# EAGLE design Netzteil_Darlington_v2 (EAGLE 8.6.3)

## Sheet 1 of 3
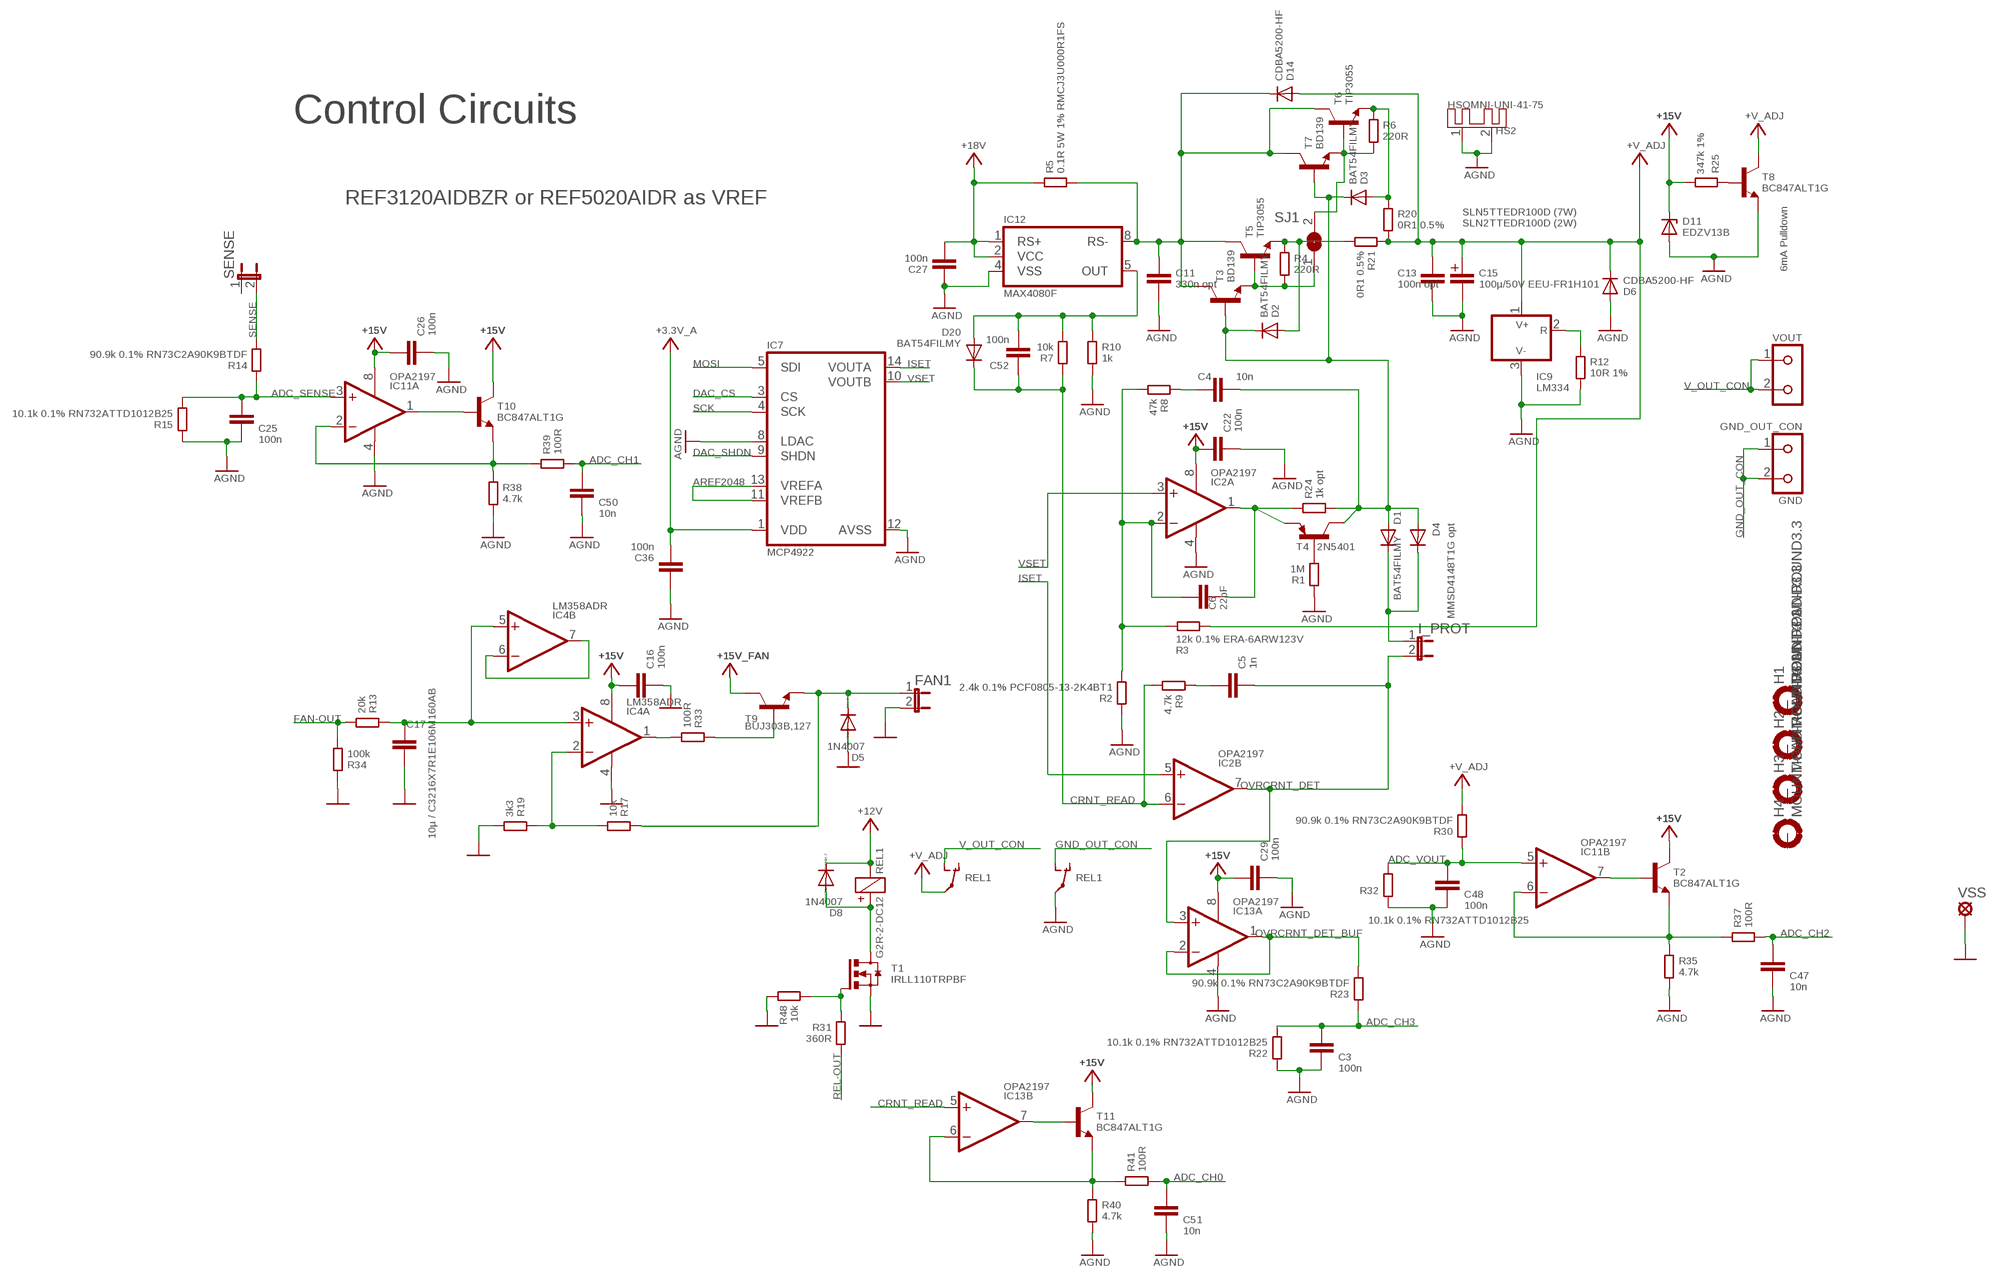
[diagram p0: schematic, sheet 1]

### Parts
C3  100n  CC/0805  [0805]
C4  10n  CC/0805  [0805]
C5  1n  CC/0805  [0805]
C6  22pF  CC/0805  [0805]
C11  330n opt  CC/0805  [0805]
C13  100n opt  CC/0805  [0805]
C15  100µ/50V EEU-FR1H101  C+3.5/8  [C+/3.5/8]
C16  100n  CC/0805  [0805]
C17  10µ / C3216X7R1E106M160AB  CC/1206  [1206]
C22  100n  CC/0805  [0805]
C25  100n  CC/0805  [0805]
C26  100n  CC/0805  [0805]
C27  100n  CC/0805  [0805]
C29  100n  CC/0805  [0805]
C36  100n  CC/0805  [0805]
C47  10n  CC/0805  [0805]
C48  100n  CC/0805  [0805]
C50  10n  CC/0805  [0805]
C51  10n  CC/0805  [0805]
C52  100n  CC/0805  [0805]
D1  BAT54FILMY  DBAT54FILMY  [SOT23]
D2  BAT54FILMY  DBAT54FILMY  [SOT23]
D3  BAT54FILMY  DBAT54FILMY  [SOT23]
D4  MMSD4148T1G opt  DIODESOD-123  [SOD-123]
D5  1N4007  DIODE-DO214AA  [DO214AA]
D6  CDBA5200-HF  [DO214AC-2]
D8  1N4007  DIODE-DO214AA  [DO214AA]
D11  EDZV13B  ZD  [SOD-523]
D14  CDBA5200-HF  [DO214AC-2]
D20  BAT54FILMY  DBAT54FILMY  [SOT23]
FAN1  JP1E  [JP1]
GND_OUT_CON  GND  KL2691311500002  [KL2-691311500002]
H1  MOUNT-PAD-ROUND3.3  [3,3-PAD]
H2  MOUNT-PAD-ROUND3.3  [3,3-PAD]
H3  MOUNT-PAD-ROUND3.3  [3,3-PAD]
H4  MOUNT-PAD-ROUND3.3  [3,3-PAD]
HS2  HSOMNI-UNI-41-75  [OMNI-UNI-41-75]
I_PROT  JP1E  [JP1]
IC2  OPA2197  DUAL-OPVSOP8  [SOP8]
IC4  LM358ADR  DUAL-OPVSOP8  [SOP8]
IC7  MCP4922  [TSSOP14]
IC9  LM334  [TO92-G]
IC11  OPA2197  DUAL-OPVSOP8  [SOP8]
IC12  MAX4080F  MAX4080  [SOP8]
IC13  OPA2197  DUAL-OPVSOP8  [SOP8]
R1  1M  R-SMD0603  [C0603K]
R2  2.4k 0.1% PCF0805-13-2K4BT1  R-SMD0805  [C0805K]
R3  12k 0.1% ERA-6ARW123V  R-SMD0805  [C0805K]
R4  220R  R-SMD0805  [C0805K]
R5  0.1R 5W 1% RMCJ3U000R1FS  R-SHUNTRMC-J3  [RMC-J3]
R6  220R  R-SMD0805  [C0805K]
R7  10k  R-SMD0805  [C0805K]
R8  47k  R-SMD0805  [C0805K]
R9  4.7k  R-SMD0805  [C0805K]
R10  1k  R-SMD0805  [C0805K]
R12  10R 1%  R-SMD0805  [C0805K]
R13  20k  R-SMD0805  [C0805K]
R14  90.9k 0.1% RN73C2A90K9BTDF  R-SMD0805  [C0805K]
R15  10.1k 0.1% RN732ATTD1012B25  R-SMD0805  [C0805K]
R17  10k  R-SMD0805  [C0805K]
R19  3k3  R-SMD0805  [C0805K]
R20  0R1 0.5%  R-SMDSLN2  [SLN2]
R21  0R1 0.5%  R-SMDSLN2  [SLN2]
R22  10.1k 0.1% RN732ATTD1012B25  R-SMD0805  [C0805K]
R23  90.9k 0.1% RN73C2A90K9BTDF  R-SMD0805  [C0805K]
R24  1k opt  R-SMD0805  [C0805K]
R25  347k 1%  R-SMD0805  [C0805K]
R30  90.9k 0.1% RN73C2A90K9BTDF  R-SMD0805  [C0805K]
R31  360R  R-SMD0805  [C0805K]
R32  10.1k 0.1% RN732ATTD1012B25  R-SMD0805  [C0805K]
R33  100R  R-SMD0805  [C0805K]
R34  100k  R-SMD0805  [C0805K]
R35  4.7k  R-SMD0805  [C0805K]
R37  100R  R-SMD0805  [C0805K]
R38  4.7k  R-SMD0805  [C0805K]
R39  100R  R-SMD0805  [C0805K]
R40  4.7k  R-SMD0805  [C0805K]
R41  100R  R-SMD0805  [C0805K]
R48  10k  R-SMD0805  [C0805K]
REL1  G2R-2-DC12  REL-2UG2R2  [REL-G2R2]
SENSE  JP1E  [JP1]
SJ1  SJ  [SJ]
T1  IRLL110TRPBF  T-NMOSFDT457N  [SOT223-4]
T2  BC847ALT1G  T-NPNSOT23-BEC  [SOT23-BEC]
T3  BD139  T-NPNTO126-ECB  [TO126]
T4  2N5401  T-PNPTO92-G-EBC  [TO92-G]
T5  TIP3055  T-NPNTOP3AV-BCE  [TOP3AV]
T6  TIP3055  T-NPNTOP3AV-BCE  [TOP3AV]
T7  BD139  T-NPNTO126-ECB  [TO126]
T8  BC847ALT1G  T-NPNSOT23-BEC  [SOT23-BEC]
T9  BUJ303B,127  -NPN-TO220V  [TO220V]
T10  BC847ALT1G  T-NPNSOT23-BEC  [SOT23-BEC]
T11  BC847ALT1G  T-NPNSOT23-BEC  [SOT23-BEC]
VOUT  KL2691311500002  [KL2-691311500002]
VSS  LSP13  [LSP13]

### Nets
+3.3V_A: C36.2 IC7.1(VDD) ; also sheet 2,3
+12V: D8.C REL1.-(1:-) ; also sheet 2
+15V: C16.1 C22.1 C26.1 C29.1 D11.C IC2.8(PWR:V+) IC4.8(PWR:V+) IC11.8(PWR:V+) IC13.8(PWR:V+) R25.2 T2.C T10.C T11.C ; also sheet 2
+15V_FAN: T9.2(C) ; also sheet 2
+18V: C27.2 IC12.1(RS+) IC12.2(VCC) R5.1 ; also sheet 2
+V_ADJ: C13.1 C15.+ D6.C D14.A IC9.1(V+) R3.1 R20.2 R21.1 R30.2 REL1.P1(2:P) T8.C
ADC_CH0: C51.1 R41.2 ; also sheet 3
ADC_CH1: C50.1 R39.2 ; also sheet 3
ADC_CH2: C47.1 R37.2 ; also sheet 3
ADC_CH3: C3.1 R22.2 R23.1 ; also sheet 3
ADC_SENSE: C25.1 IC11.3(A:+IN) R14.1 R15.2
ADC_VOUT: C48.1 IC11.5(B:+IN) R30.1 R32.2
AGND: C3.2 C11.2 C13.2 C15.- C22.2 C25.2 C26.2 C27.1 C29.2 C36.1 C47.2 C48.2 C50.2 C51.2 D6.A D11.A HS2.1 HS2.2 IC2.4(PWR:V-) IC7.8(LDAC) IC7.12(AVSS) IC9.3(V-) IC11.4(PWR:V-) IC12.4(VSS) IC13.4(PWR:V-) R1.1 R2.1 R10.2 R12.2 R15.1 R22.1 R32.1 R35.2 R38.2 R40.2 REL1.P2(3:P) T8.E ; also sheet 2,3
AREF2048: IC7.11(VREFB) IC7.13(VREFA) ; also sheet 3
CRNT_READ: C52.1 D20.3(C) IC2.6(B:-IN) IC13.5(B:+IN) R7.1 R9.2
DAC_CS: IC7.3(CS) ; also sheet 3
DAC_SHDN: IC7.9(SHDN) ; also sheet 3
FAN-OUT: R13.2 R34.2 ; also sheet 3
GND_OUT_CON: GND_OUT_CON.1 GND_OUT_CON.2 REL1.S2(3:S)
ISET: IC2.5(B:+IN) IC7.14(VOUTA)
MOSI: IC7.5(SDI) ; also sheet 3
N$3: C11.1 D14.C IC12.8(RS-) R5.2 T3.2(C) T5.C T6.C T7.2(C)
N$4: D3.1(A) R6.1 R20.1 T6.E
N$5: R6.2 SJ1.2 T6.B T7.1(E)
N$6: C6.1 IC2.2(A:-IN) R2.2 R3.2 R8.2
N$7: C52.2 D20.1(A) IC12.5(OUT) R7.2 R10.1
N$8: D2.1(A) R4.1 R21.2 T5.E
N$10: D1.3(C) D4.C I_PROT.1
N$11: R25.1 T8.B
N$12: D8.A REL1.+(1:+) T1.2(D) T1.4(D)
N$15: R4.2 SJ1.1 T3.1(E) T5.B
N$16: IC9.2(R) R12.1
N$18: IC4.6(B:-IN) IC4.7(B:OUT)
N$19: R1.2 T4.2(B)
N$21: C6.2 IC2.1(A:OUT) R24.1 T4.1(E)
N$22: C4.2 D1.1(A) D2.3(C) D3.3(C) D4.A R24.2 T3.3(B) T4.3(C) T7.3(B)
N$27: C4.1 R8.1
N$28: C5.1 R9.1
N$30: C17.2 IC4.3(A:+IN) IC4.5(B:+IN) R13.1
N$31: D5.C FAN1.1 R17.1 T9.3(E)
N$32: IC4.2(A:-IN) R17.2 R19.1
N$33: R33.1 T9.1(B)
N$34: IC4.1(A:OUT) R33.2
N$37: R31.1 R48.2 T1.1(G)
N$40: IC11.7(B:OUT) T2.B
N$41: IC11.6(B:-IN) R35.1 R37.1 T2.E
N$42: IC11.1(A:OUT) T10.B
N$43: IC11.2(A:-IN) R38.1 R39.1 T10.E
N$44: IC13.7(B:OUT) T11.B
N$45: IC13.6(B:-IN) R40.1 R41.1 T11.E
OVRCRNT_DET: C5.2 I_PROT.2 IC2.7(B:OUT) IC13.3(A:+IN)
OVRCRNT_DET_BUF: IC13.1(A:OUT) IC13.2(A:-IN) R23.2
REL-OUT: R31.2 ; also sheet 3
SCK: IC7.4(SCK) ; also sheet 3
SENSE: R14.2 SENSE.2
V_OUT_CON: REL1.S1(2:S) VOUT.1 VOUT.2
VSET: IC2.3(A:+IN) IC7.10(VOUTB)
VSS: C16.2 C17.1 D5.A FAN1.2 IC4.4(PWR:V-) R19.2 R34.1 R48.1 T1.3(S) VSS.MP ; also sheet 2,3
Unconnected: H1.B3,3(MOUNT) H2.B3,3(MOUNT) H3.B3,3(MOUNT) H4.B3,3(MOUNT) REL1.O1(2:O) REL1.O2(3:O) SENSE.1

### Notes on the sheet
- Control Circuits
- REF3120AIDBZR or REF5020AIDR as VREF
- SLN5TTEDR100D (7W)
  SLN2TTEDR100D (2W)
- 6mA Pulldown

## Sheet 2 of 3
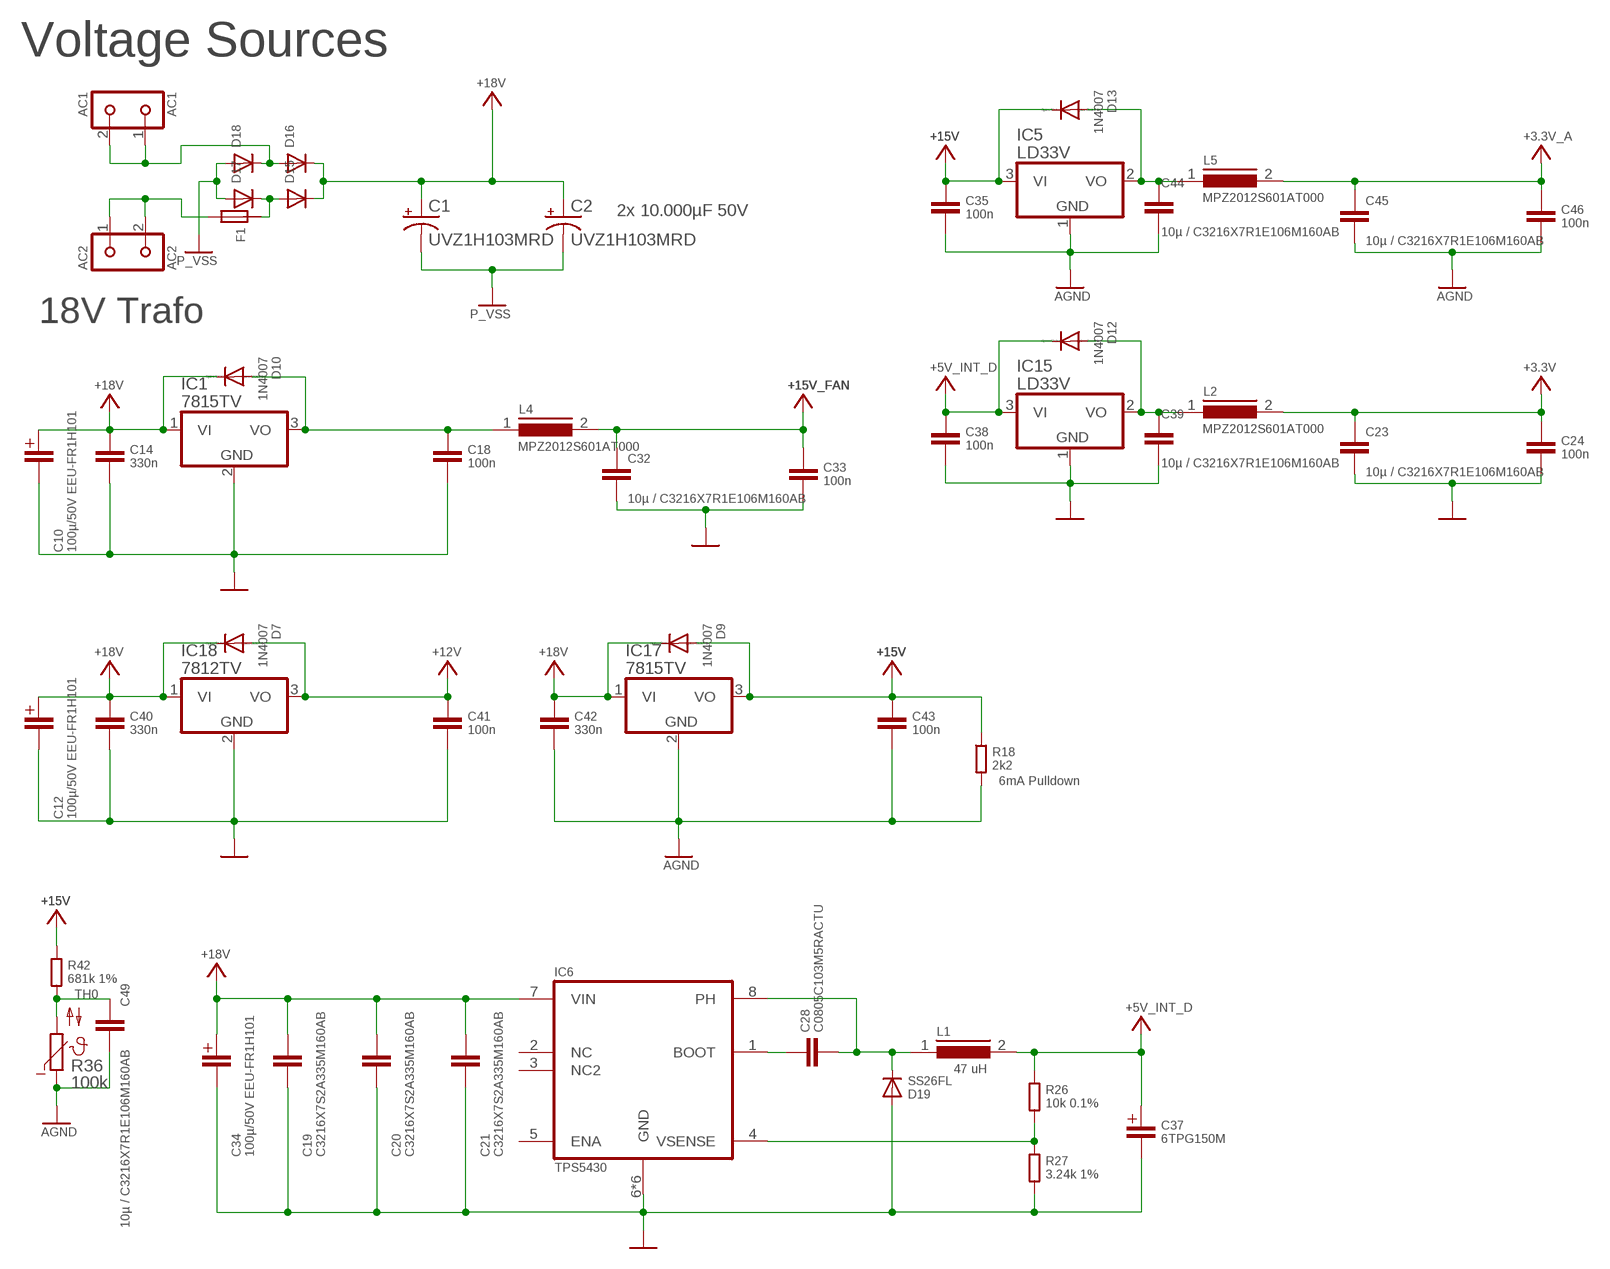
[diagram p1: schematic, sheet 2]

### Parts
AC1  AC1  KL2691311500002  [KL2-691311500002]
AC2  AC2  KL2691311500002  [KL2-691311500002]
C1  UVZ1H103MRD  CPOL-USE10-22.5  [EB22,5D]
C2  UVZ1H103MRD  CPOL-USE10-22.5  [EB22,5D]
C10  100µ/50V EEU-FR1H101  C+3.5/8  [C+/3.5/8]
C12  100µ/50V EEU-FR1H101  C+3.5/8  [C+/3.5/8]
C14  330n  CC/0805  [0805]
C18  100n  CC/0805  [0805]
C19  C3216X7S2A335M160AB  CC/1206  [1206]
C20  C3216X7S2A335M160AB  CC/1206  [1206]
C21  C3216X7S2A335M160AB  CC/1206  [1206]
C23  10µ / C3216X7R1E106M160AB  CC/1206  [1206]
C24  100n  CC/0805  [0805]
C28  C0805C103M5RACTU  CC/0805  [0805]
C32  10µ / C3216X7R1E106M160AB  CC/1206  [1206]
C33  100n  CC/0805  [0805]
C34  100µ/50V EEU-FR1H101  C+3.5/8  [C+/3.5/8]
C35  100n  CC/0805  [0805]
C37  6TPG150M  C-TANTAL  [CT1210]
C38  100n  CC/0805  [0805]
C39  10µ / C3216X7R1E106M160AB  CC/1206  [1206]
C40  330n  CC/0805  [0805]
C41  100n  CC/0805  [0805]
C42  330n  CC/0805  [0805]
C43  100n  CC/0805  [0805]
C44  10µ / C3216X7R1E106M160AB  CC/1206  [1206]
C45  10µ / C3216X7R1E106M160AB  CC/1206  [1206]
C46  100n  CC/0805  [0805]
C49  10µ / C3216X7R1E106M160AB  CC/1206  [1206]
D7  1N4007  DIODE-DO214AA  [DO214AA]
D9  1N4007  DIODE-DO214AA  [DO214AA]
D10  1N4007  DIODE-DO214AA  [DO214AA]
D12  1N4007  DIODE-DO214AA  [DO214AA]
D13  1N4007  DIODE-DO214AA  [DO214AA]
D15  DTO263-PWR  [TO-263AB-PWR]
D16  DTO263-PWR  [TO-263AB-PWR]
D17  DTO263-PWR  [TO-263AB-PWR]
D18  DTO263-PWR  [TO-263AB-PWR]
D19  SS26FL  DSOD123  [SOD-123]
F1  F5X20  [F5X20]
IC1  7815TV  [TO220V]
IC5  LD33V  [TO220V]
IC6  TPS5430  [SOIC8POWERPAD]
IC15  LD33V  [TO220V]
IC17  7815TV  [TO220V]
IC18  7812TV  [TO220V]
L1  47 uH  L744771147  [WE-PD]
L2  MPZ2012S601AT000  L0805  [C0805K]
L4  MPZ2012S601AT000  L0805  [C0805K]
L5  MPZ2012S601AT000  L0805  [C0805K]
R18  2k2  R-SMD0805  [C0805K]
R26  10k 0.1%  R-SMD0805  [C0805K]
R27  3.24k 1%  R-SMD0805  [C0805K]
R36  100k  NTC640  [P640]
R42  681k 1%  R-SMD0603  [C0603K]

### Nets
+3.3V: C23.1 C24.1 L2.2 ; also sheet 3
+3.3V_A: C45.1 C46.1 L5.2 ; also sheet 1,3
+5V_INT_D: C37.+ C38.1 D12.C IC15.3(VI) L1.2 R26.1 ; also sheet 3
+12V: C41.1 D7.A IC18.3(VO) ; also sheet 1
+15V: C35.1 C43.1 D9.A D13.C IC5.3(VI) IC17.3(VO) R18.1 R42.1 ; also sheet 1
+15V_FAN: C32.1 C33.1 L4.2 ; also sheet 1
+18V: C1.+ C2.+ C10.+ C12.+ C14.1 C19.1 C20.1 C21.1 C34.+ C40.1 C42.1 D7.C D9.C D10.C D15.2(C) D15.2_PWR1(C) D15.2_PWR2(C) D15.2_PWR3(C) D15.2_PWR4(C) D15.2_PWR5(C) D15.2_PWR6(C) D15.2_PWR7(C) D15.2_PWR8(C) D15.2_PWR9(C) D15.2_PWR10(C) D15.2_PWR11(C) D15.2_PWR12(C) D16.2(C) D16.2_PWR1(C) D16.2_PWR2(C) D16.2_PWR3(C) D16.2_PWR4(C) D16.2_PWR5(C) D16.2_PWR6(C) D16.2_PWR7(C) D16.2_PWR8(C) D16.2_PWR9(C) D16.2_PWR10(C) D16.2_PWR11(C) D16.2_PWR12(C) IC1.1(VI) IC6.7(VIN) IC17.1(VI) IC18.1(VI) ; also sheet 1
AGND: C35.2 C42.2 C43.2 C44.1 C45.2 C46.2 C49.1 IC5.1(GND) IC17.2(GND) R18.2 R36.1 ; also sheet 1,3
N$1: C28.1 IC6.1(BOOT)
N$2: AC2.1 AC2.2 F1.3 F1.4
N$13: C28.2 D19.-(C) IC6.8(PH) L1.1
N$14: AC1.1 AC1.2 D16.1(A) D16.3(A) D18.2(C) D18.2_PWR1(C) D18.2_PWR2(C) D18.2_PWR3(C) D18.2_PWR4(C) D18.2_PWR5(C) D18.2_PWR6(C) D18.2_PWR7(C) D18.2_PWR8(C) D18.2_PWR9(C) D18.2_PWR10(C) D18.2_PWR11(C) D18.2_PWR12(C)
N$24: IC6.4(VSENSE) R26.2 R27.1
N$25: D15.1(A) D15.3(A) D17.2(C) D17.2_PWR1(C) D17.2_PWR2(C) D17.2_PWR3(C) D17.2_PWR4(C) D17.2_PWR5(C) D17.2_PWR6(C) D17.2_PWR7(C) D17.2_PWR8(C) D17.2_PWR9(C) D17.2_PWR10(C) D17.2_PWR11(C) D17.2_PWR12(C) F1.1 F1.2
N$35: C39.2 D12.A IC15.2(VO) L2.1
N$38: C18.1 D10.A IC1.3(VO) L4.1
N$39: C44.2 D13.A IC5.2(VO) L5.1
P_VSS: C1.- C2.- D17.1(A) D17.3(A) D18.1(A) D18.3(A)
TH0: C49.2 R36.2 R42.2 ; also sheet 3
VSS: C10.- C12.- C14.2 C18.2 C19.2 C20.2 C21.2 C23.2 C24.2 C32.2 C33.2 C34.- C37.- C38.2 C39.1 C40.2 C41.2 D19.+(A) IC1.2(GND) IC6.6(GND) IC6.POWERPAD(GND) IC6.PP1(GND) IC6.PP2(GND) IC6.PP3(GND) IC6.PP4(GND) IC15.1(GND) IC18.2(GND) R27.2 ; also sheet 1,3
Unconnected: IC6.2(NC) IC6.3(NC2) IC6.5(ENA)

### Notes on the sheet
- Voltage Sources
- 2x 10.000µF 50V
- 18V Trafo
- 6mA Pulldown

## Sheet 3 of 3
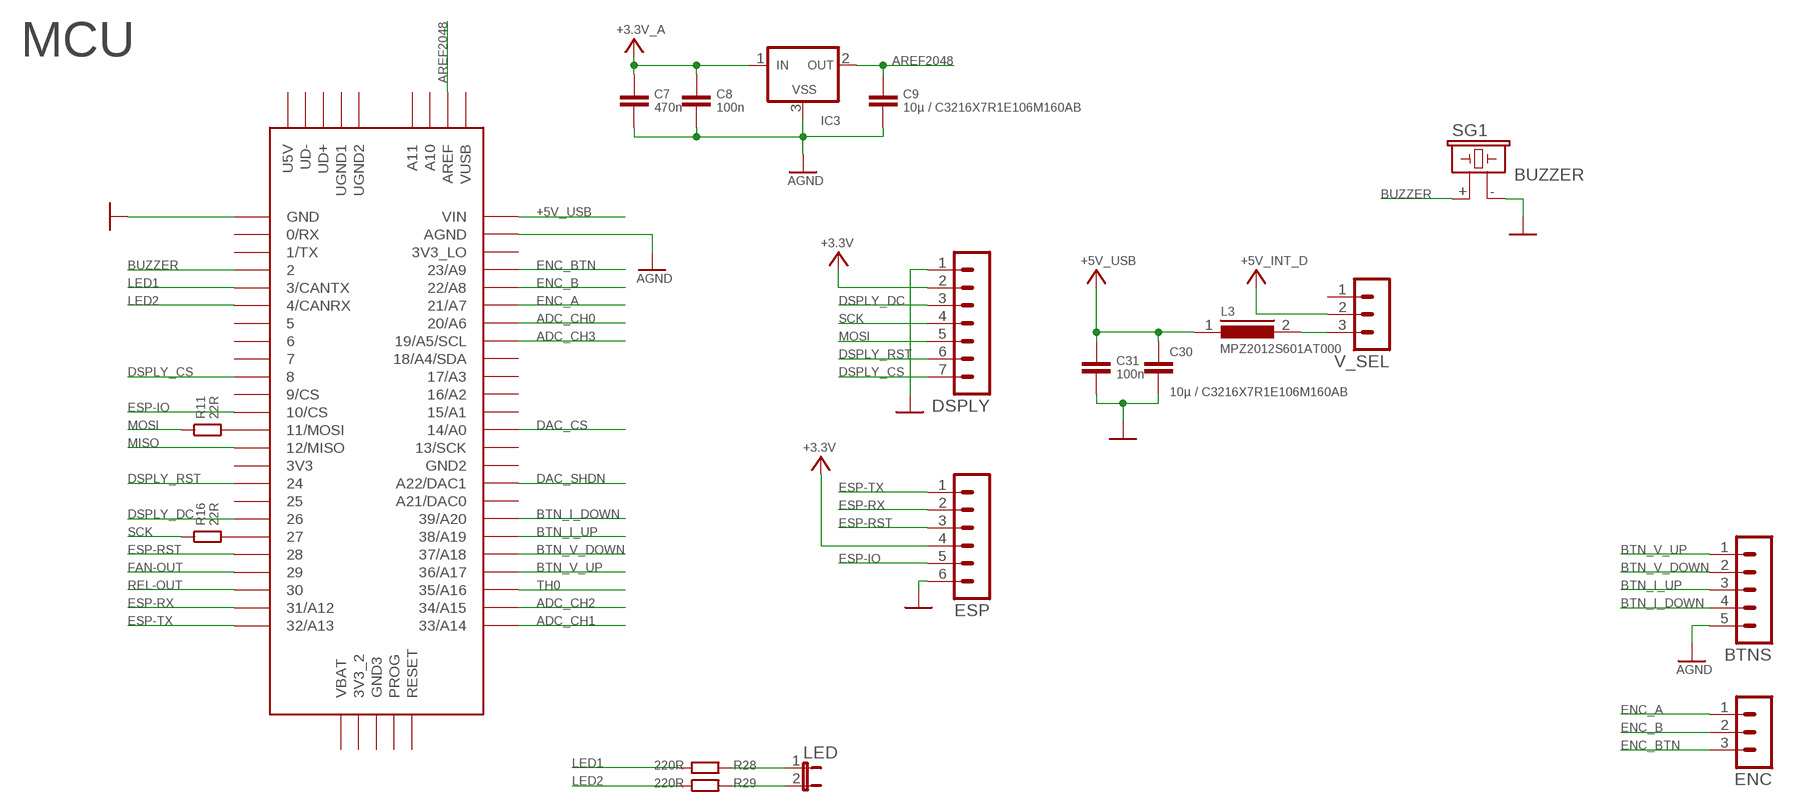
[diagram p2: schematic, sheet 3]

### Parts
BTNS  MA05-1  [MA05-1]
C7  470n  CC/0805  [0805]
C8  100n  CC/0805  [0805]
C9  10µ / C3216X7R1E106M160AB  CC/1206  [1206]
C30  10µ / C3216X7R1E106M160AB  CC/1206  [1206]
C31  100n  CC/0805  [0805]
DSPLY  MA07-1  [MA07-1]
ENC  MA03-1  [MA03-1]
ESP  MA06-1  [MA06-1]
IC3  REF3120  [SOT23]
L3  MPZ2012S601AT000  L0805  [C0805K]
LED  JP1E  [JP1]
R11  22R  R-SMD0805  [C0805K]
R16  22R  R-SMD0805  [C0805K]
R28  220R  R-SMD0805  [C0805K]
R29  220R  R-SMD0805  [C0805K]
SG1  BUZZER  [254-EMB73-RO]
U$33  TEENSY_3.5/3.6  [TEENSY_3.5/3.6]
V_SEL  MA03-1  [MA03-1]

### Nets
+3.3V: DSPLY.2 ESP.4 ; also sheet 2
+3.3V_A: C7.1 C8.1 IC3.1(IN) ; also sheet 1,2
+5V_INT_D: V_SEL.2 ; also sheet 2
+5V_USB: C30.1 C31.1 L3.1 U$33.VIN
ADC_CH0: U$33.20/A6 ; also sheet 1
ADC_CH1: U$33.33/A14 ; also sheet 1
ADC_CH2: U$33.34/A15 ; also sheet 1
ADC_CH3: U$33.19/A5/SCL ; also sheet 1
AGND: BTNS.5 C7.2 C8.2 C9.2 IC3.3(VSS) U$33.AGND ; also sheet 1,2
AREF2048: C9.1 IC3.2(OUT) U$33.AREF ; also sheet 1
BTN_I_DOWN: BTNS.4 U$33.39/A20
BTN_I_UP: BTNS.3 U$33.38/A19
BTN_V_DOWN: BTNS.2 U$33.37/A18
BTN_V_UP: BTNS.1 U$33.36/A17
BUZZER: SG1.+ U$33.2
DAC_CS: U$33.14/A0 ; also sheet 1
DAC_SHDN: U$33.A22/DAC1 ; also sheet 1
DSPLY_CS: DSPLY.7 U$33.8
DSPLY_DC: DSPLY.3 U$33.26
DSPLY_RST: DSPLY.6 U$33.24
ENC_A: ENC.1 U$33.21/A7
ENC_B: ENC.2 U$33.22/A8
ENC_BTN: ENC.3 U$33.23/A9
ESP-IO: ESP.5 U$33.10/CS
ESP-RST: ESP.3 U$33.28
ESP-RX: ESP.2 U$33.31/A12
ESP-TX: ESP.1 U$33.32/A13
FAN-OUT: U$33.29 ; also sheet 1
LED1: R28.1 U$33.3/CANTX
LED2: R29.1 U$33.4/CANRX
MISO: U$33.12/MISO
MOSI: DSPLY.5 R11.1 ; also sheet 1
N$9: R16.2 U$33.27
N$17: R11.2 U$33.11/MOSI
N$20: LED.1 R28.2
N$23: LED.2 R29.2
N$36: L3.2 V_SEL.3
REL-OUT: U$33.30 ; also sheet 1
SCK: DSPLY.4 R16.1 ; also sheet 1
TH0: U$33.35/A16 ; also sheet 2
VSS: C30.2 C31.2 DSPLY.1 ESP.6 SG1.- U$33.GND ; also sheet 1,2
Unconnected: U$33.0/RX U$33.1/TX U$33.3V3 U$33.3V3_2 U$33.3V3_LO U$33.5 U$33.6 U$33.7 U$33.9/CS U$33.13/SCK U$33.15/A1 U$33.16/A2 U$33.17/A3 U$33.18/A4/SDA U$33.21/DAC0(A21/DAC0) U$33.25 U$33.A10 U$33.A11 U$33.GND2 U$33.GND3 U$33.PROG U$33.RESET U$33.U5V U$33.UD+ U$33.UD- U$33.UGND1 U$33.UGND2 U$33.VBAT U$33.VUSB V_SEL.1

### Notes on the sheet
- MCU

## Library data of the parts
AC1 AC2 GND_OUT_CON VOUT = neumluc:KL2: Printklemme 2-polig
BTNS = con-lstb:MA05-1: PIN HEADER; OC_FARNELL: unknown; OC_NEWARK: unknown
C1 C2 = neumluc:CPOL-US: POLARIZED CAPACITOR, American symbol
C3-C9 C11 C13 C14 C16-C33 C35 C36 C38-C52 = goujine:C: Kondensator
C10 C12 C15 C34 = goujine:C+
C37 = neumluc:C-TANTAL
D1-D3 D15-D20 = neumluc:D
D4 = adafruit:DIODE: Diode SMADIODE - SMA Surface Mount Package 20V 1A Schottky Diode Digikey: 641-1014-6-ND DO-1N4148 - Through Hole Small Current Diode SOD-123 20V 1 A (.5mV Vf) Schottky Diode - Digikey: MBRX120TPMSCT-ND SOD-323 10V 570mA (.38mV Vf, 3ns) Schottky Diode - Digikey: ZLLS410CT-ND SOD-523 30V 30mA Schottky Diode (RB751S-40TE61) - Digikey: RB751S-40TE61CT-ND SOT23-R/W - SOT23 Package (R = Solder Paste/Reflow Ovens, W = Hand-Soldering) BAT54Film 40V 300mA - Digikey: 497-7162-1-ND
D5 D7-D10 D12 D13 = diode:DIODE-: DIODE
D6 D14 = neumluc:CDBA5200-HF
D11 = neumluc:ZD
DSPLY = con-lstb:MA07-1: PIN HEADER; OC_FARNELL: unknown; OC_NEWARK: unknown
ENC V_SEL = con-lstb:MA03-1: PIN HEADER; OC_FARNELL: unknown; OC_NEWARK: unknown
ESP = con-lstb:MA06-1: PIN HEADER; OC_FARNELL: unknown; OC_NEWARK: unknown
F1 = goujine:F: Sicherung
FAN1 I_PROT LED SENSE = jumper:JP1E: JUMPER
H1-H4 = holes:MOUNT-PAD-ROUND: MOUNTING PAD, round
HS2 = neumluc:HS
IC1 IC17 IC18 = linear:78*: Positive VOLTAGE REGULATOR Source: http://cache.national.com/ds/LM/LM78L05.pdf http://www.fairchildsemi.com/ds/LM/LM7805.pdf
IC2 IC4 IC11 IC13 = goujine:DUAL-OPV
IC3 = neumluc:REF3120
IC5 IC15 = neumluc:LD33V
IC6 = neumluc:TPS5430
IC7 = neumluc:MCP4922
IC9 = neumluc:LM334: LM134/LM234/LM334 3-Terminal Adjustable Current Sources
IC12 = neumluc:MAX4080
L1 = neumluc:L: High Power Density, High Efficiency, Shielded Inductors; SPICEPREFIX: L
L2-L5 = neumluc:L: High Power Density, High Efficiency, Shielded Inductors
R1-R4 R6-R35 R37-R42 R48 = neumluc:R-SMD: R SMD
R5 = neumluc:R-SHUNT
R36 = ptc-ntc:NTC640: PHILIPS NTC; OC_FARNELL: unknown; OC_NEWARK: unknown
REL1 = goujine:REL-2U
SG1 = neumluc:BUZZER: BUZZER Source: Buerklin; OC_FARNELL: unknown; OC_NEWARK: unknown
SJ1 = jumper:SJ: SMD solder JUMPER
T1 = goujine:T-NMOS: Transistor N-Channel MOSFET
T2 T3 T5-T8 T10 T11 = neumluc:T-NPN: NPN Transistor
T4 = neumluc:T-PNP: PNP Transistor
T9 = transistor:*-NPN-: NPN Transistror BF959 corrected 2008.03.06
U$33 = Teensy356:TEENSY_3.5/3.6
VSS = solpad:LSP13: SOLDER PAD drill 1.3 mm, distributor Buerklin, 12H562

## Board
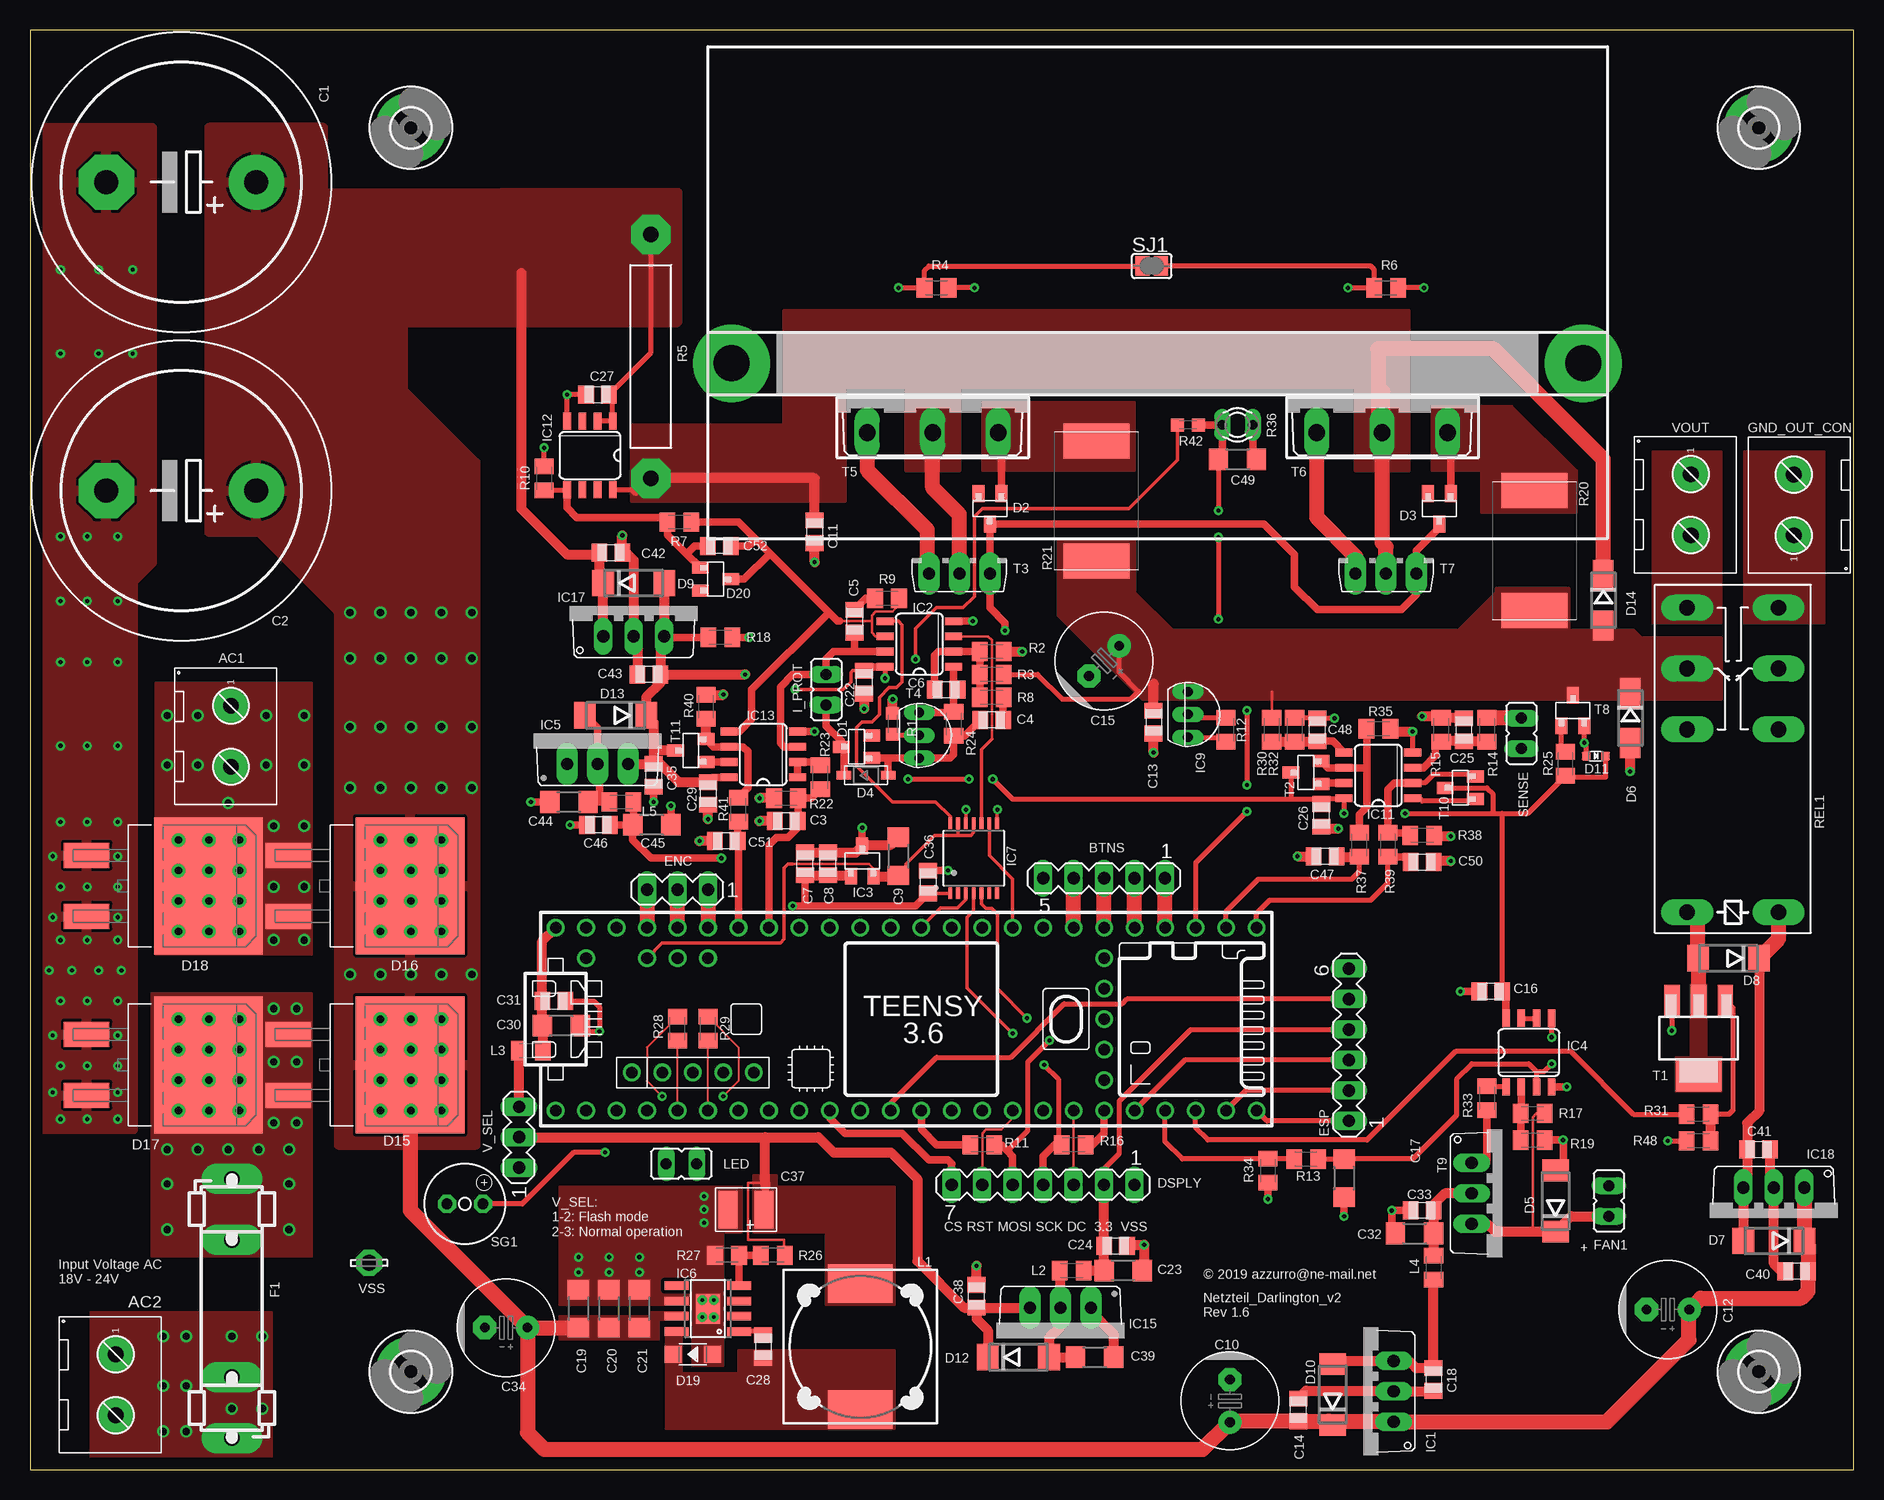
[diagram p3: board, top side]
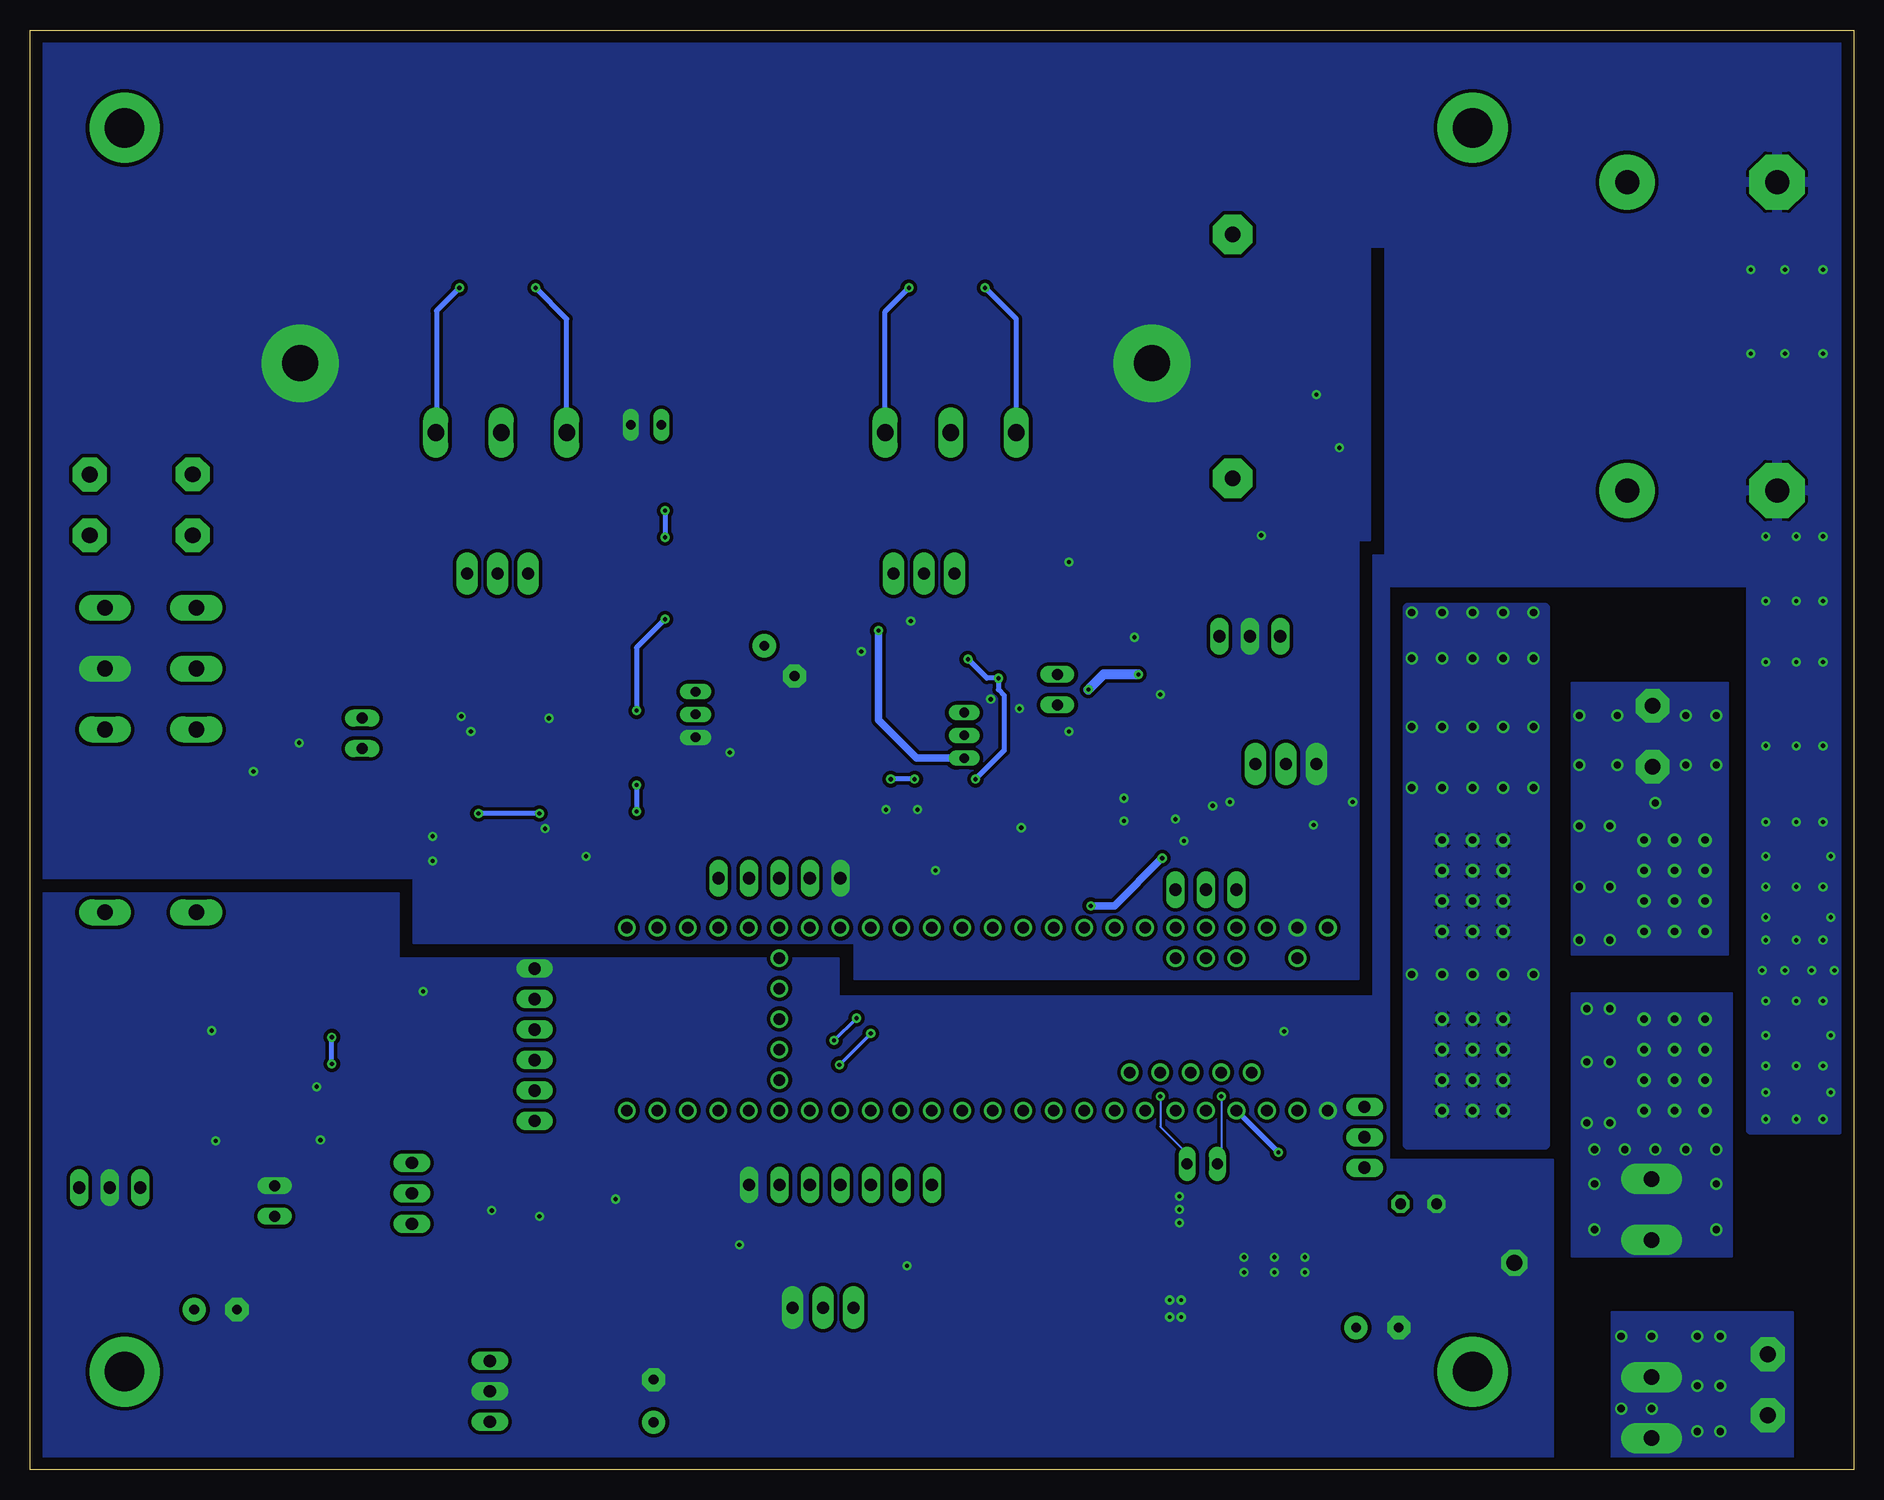
[diagram p4: board, bottom side, seen from below]

Size 152 x 120 mm. Coordinates in mm from the lower left corner, seen from the top.
Outline: 0,0 152,0 152,120 0,120 0,0
Copper layers (1*16): Top 0.035mm / dielectric 1.5mm / Bottom 0.035mm
Design rules "default *": minimum track width 6mil, minimum drill 0.2mm, track to track 6mil, track to pad 6mil, pad to pad 6mil, via to via 6mil, smd to smd 6mil, copper to edge 40mil, drill to drill 6mil, minimum pad ring 10mil, minimum via ring 8mil, stop-mask expansion 4mil, vias tented up to drill 0mil, thermal gap 10mil

### Footprints (pad centres in the part's own frame; a part is rotated, then mirrored left to right if it is on the bottom)
KL2-691311500002 = drill 1.3 pad 2.8 octagon: 1 -2.54,0; 2 2.54,0
MA05-1 = drill 1.016 long: 1 -5.08,0; 2 -2.54,0; 3 0,0; 4 2.54,0; 5 5.08,0
EB22,5D = drill 2.007 pad 4.597: + -6.25,0 | drill 2.007 pad 4.597 octagon: - 6.25,0
0805 = smd 1.3 x 1.5: 1 -0.953,0; 2 0.953,0
1206 = smd 1.803 x 1.6: 1 0,1.587; 2 0,-1.587
C+/3.5/8 = drill 0.813 pad 1.93: + -1.778,0 | drill 0.813 pad 1.93 octagon: - 1.778,0
CT1210 = smd 1.55 x 3.1: + -1.5,0; - 1.5,0
SOT23 = smd 1 x 1.4: 1 -0.953,-1.27; 2 0.953,-1.27; 3 0,1.27
SOD-123 = smd 1.2 x 0.7: A 1.85,0; C -1.85,0
DO214AA = smd 1.8 x 2.2: A 2.55,0; C -2.55,0
DO214AC-2 = smd 2.5 x 1.7: A 2.1,0; C -2.1,0
SOD-523 = smd 0.762 x 0.7: A -0.8,0; C 0.8,0
TO-263AB-PWR = smd 2.08 x 3.8: 1 -2.54,-6.4; 3 2.54,-6.4 | smd 11.43 x 9.05: 2 0,3.75 | drill 0.6: 2_PWR1 -3.81,6.35; 2_PWR2 -1.27,6.35; 2_PWR3 1.27,6.35; 2_PWR4 3.81,6.35; 2_PWR5 3.81,3.81; 2_PWR6 1.27,3.81; 2_PWR7 -1.27,3.81; 2_PWR8 -3.81,3.81; 2_PWR9 -3.81,1.27; 2_PWR10 -1.27,1.27; 2_PWR11 1.27,1.27; 2_PWR12 3.81,1.27
SOD-123' = smd 1.397 x 1.397: + -1.651,0; - 1.651,0
MA07-1 = drill 1.016 long: 1 -7.62,0; 2 -5.08,0; 3 -2.54,0; 4 0,0; 5 2.54,0; 6 5.08,0; 7 7.62,0
MA03-1 = drill 1.016 long: 1 -2.54,0; 2 0,0; 3 2.54,0
MA06-1 = drill 1.016 long: 1 -6.35,0; 2 -3.81,0; 3 -1.27,0; 4 1.27,0; 5 3.81,0; 6 6.35,0
F5X20 = drill 1.3 pad 2.54 long: 1 -11.43,0; 2 -6.35,0; 3 5.08,0; 4 10.16,0
JP1 = drill 0.914 long: 1 0,-1.27; 2 0,1.27
3,3-PAD = drill 3.3 pad 5.842: B3,3 0,0
OMNI-UNI-41-75 = drill 3 pad 6.452: 1 -35.5,2.6; 2 35.5,2.6
TO220V = drill 1.016 long: 1 -2.54,-2.54; 2 0,-2.54; 3 2.54,-2.54
SOP8 = smd 0.635 x 1.422: 1 -1.905,-2.857; 2 -0.635,-2.857; 3 0.635,-2.857; 4 1.905,-2.857; 5 1.905,2.857; 6 0.635,2.857; 7 -0.635,2.857; 8 -1.905,2.857
TO220V' = drill 1 pad 1.778 long: 1 -2.54,0; 2 0,0; 3 2.54,0
SOIC8POWERPAD = smd 0.72 x 2: 1 -1.905,-2.6; 2 -0.635,-2.6; 3 0.635,-2.6; 4 1.905,-2.6; 5 1.905,2.6; 6 0.635,2.6; 7 -0.635,2.6; 8 -1.905,2.6 | smd 2.5 x 2: POWERPAD 0,0 | drill 0.3 pad 0.7: PP1 -0.714,0.476; PP2 0.714,0.476; PP3 -0.714,-0.476; PP4 0.714,-0.476
TSSOP14 = smd 0.305 x 0.991: 1 -1.95,-2.918; 2 -1.3,-2.918; 3 -0.65,-2.918; 4 0,-2.918; 5 0.65,-2.918; 6 1.3,-2.918; 7 1.95,-2.918; 8 1.95,2.918; 9 1.3,2.918; 10 0.65,2.918; 11 0,2.918; 12 -0.65,2.918; 13 -1.3,2.918; 14 -1.95,2.918
TO92-G = drill 0.8 pad 1.27 long: 1 -1.905,0; 2 0,0; 3 1.905,0
WE-PD = smd 3.2 x 5.4: 1 -5.25,0; 2 5.25,0
C0805K = smd 1.3 x 1.6: 1 -1,0; 2 1,0
C0603K = smd 1.05 x 1.08: 1 -0.875,0; 2 0.875,0
RMC-J3 = drill 1.3 pad 3.3 octagon: 1 -10.16,0; 2 10.16,0
SLN2 = smd 2.9 x 5.5: 1 -5,0; 2 5,0
P640 = drill 0.813 long: 1 -1.27,0; 2 1.27,0
REL-G2R2 = drill 1.3 pad 2.184 long: + -12.7,3.81; - -12.7,-3.81; O1 2.54,3.81; O2 2.54,-3.81; P1 7.62,3.81; P2 7.62,-3.81; S1 12.7,3.81; S2 12.7,-3.81
254-EMB73-RO = drill 0.9 pad 1.5 octagon: + 1.5,0; - -1.5,0
SJ = smd 1.168 x 1.6: 1 -0.762,0; 2 0.762,0
SOT223-4 = smd 1.27 x 2.54: 1 -2.223,-3.175; 2 0,-3.175; 3 2.223,-3.175 | smd 3.81 x 2.54: 4 0,3.175
SOT23-BEC = smd 1 x 1.4: B -0.953,-1.27; C 0,1.27; E 0.953,-1.27
TO126 = drill 1 pad 1.778 long: 1 -2.54,0; 2 0,0; 3 2.54,0
TOP3AV = drill 1.397 long: B -5.461,-3.175; C 0,-3.175; E 5.461,-3.175
TEENSY_3.5/3.6 = drill 0.965: 0/RX -25.4,-7.62; 1/TX -22.86,-7.62; 2 -20.32,-7.62; 3/CANTX -17.78,-7.62; 3V3 7.62,-7.62; 3V3_2 17.78,-2.54; 3V3_LO -22.86,7.62; 4/CANRX -15.24,-7.62; 5 -12.7,-7.62; 6 -10.16,-7.62; 7 -7.62,-7.62; 8 -5.08,-7.62; 9/CS -2.54,-7.62; 10/CS 0,-7.62; 11/MOSI 2.54,-7.62; 12/MISO 5.08,-7.62; 13/SCK 5.08,7.62; 14/A0 2.54,7.62; 15/A1 0,7.62; 16/A2 -2.54,7.62; 17/A3 -5.08,7.62; 18/A4/SDA -7.62,7.62; 19/A5/SCL -10.16,7.62; 20/A6 -12.7,7.62; 21/A7 -15.24,7.62; 21/DAC0 12.7,7.62; 22/A8 -17.78,7.62; 23/A9 -20.32,7.62; 24 10.16,-7.62; 25 12.7,-7.62; 26 15.24,-7.62; 27 17.78,-7.62; 28 20.32,-7.62; 29 22.86,-7.62; 30 25.4,-7.62; 31/A12 27.94,-7.62; 32/A13 30.48,-7.62; 33/A14 30.48,7.62; 34/A15 27.94,7.62; 35/A16 25.4,7.62; 36/A17 22.86,7.62; 37/A18 20.32,7.62; 38/A19 17.78,7.62; 39/A20 15.24,7.62; A10 -17.78,5.08; A11 -15.24,5.08; A22/DAC1 10.16,7.62; AGND -25.4,7.62; AREF -20.32,5.08; GND -27.94,-7.62; GND2 7.62,7.62; GND3 17.78,0; PROG 17.78,2.54; RESET 17.78,5.08; U5V -21.59,-4.445; UD+ -16.51,-4.445; UD- -19.05,-4.445; UGND1 -13.97,-4.445; UGND2 -11.43,-4.445; VBAT 17.78,-5.08; VIN -27.94,7.62; VUSB -25.4,5.08
LSP13 = drill 1.321 pad 2.159 octagon: MP 0,0

### Placement (x,y rotation side)
AC1  16.75,61.12 270 top
AC2  7.14,7.06 270 top
BTNS  89.53,49.29 180 top
C1  12.62,107.31 180 top
C2  12.62,81.6 180 top
C3  63.02,54.05 180 top
C4  80.17,62.47 180 top
C5  68.74,70.72 270 top
C6  76.36,65.01 0 top
C7  64.61,50.48 90 top
C8  66.52,50.48 90 top
C9  72.39,51.12 180 top
C10  100.01,5.71 90 top
C11  65.41,78.19 270 top
C12  136.53,13.34 180 top
C13  93.66,62.31 270 top
C14  105.72,4.98 90 top
C15  89.54,67.41 225 top
C16  121.76,39.85 180 top
C17  109.54,24.29 180 top
C18  117,7.52 270 top
C19  45.72,13.41 180 top
C20  48.26,13.41 180 top
C21  50.8,13.41 180 top
C22  69.53,65.64 270 top
C23  91.12,16.59 90 top
C24  90.49,18.65 0 top
C25  119.54,61.67 90 top
C26  107.63,54.53 270 top
C27  47.31,89.61 0 top
C28  61.12,10.24 270 top
C29  56.52,56.36 270 top
C30  44.29,36.99 90 top
C31  43.66,39.05 0 top
C32  115.41,19.68 270 top
C33  116.05,21.59 180 top
C34  39.69,11.83 180 top
C35  51.99,57.86 270 top
C36  74.85,48.97 270 top
C37  59.69,21.67 180 top
C38  78.9,14.45 90 top
C39  88.74,9.36 270 top
C40  147.27,16.52 180 top
C41  144.09,26.68 0 top
C42  48.42,76.44 0 top
C43  51.59,66.28 180 top
C44  44.93,55.64 90 top
C45  51.83,53.74 90 top
C46  47.39,53.74 180 top
C47  107.95,51.12 180 top
C48  107.31,61.67 90 top
C49  100.65,84.22 270 top
C50  116.05,50.64 0 top
C51  58.02,52.39 180 top
C52  57.47,76.99 180 top
D1  68.9,60.25 90 top
D2  80.01,80.09 180 top
D3  117.47,80.09 180 top
D4  69.69,57.87 0 top
D5  127.16,22.38 90 top
D6  133.38,62.64 270 top
D7  145.36,19.06 180 top
D8  141.58,42.61 180 top
D9  50.32,73.9 0 top
D10  108.58,6.25 90 top
D11  130.52,59.47 0 top
D12  82.39,9.36 0 top
D13  48.82,62.87 180 top
D14  131.13,72.47 270 top
D15  27.94,33.73 270 top
D16  27.94,48.66 270 top
D17  11.11,33.73 270 top
D18  11.11,48.66 270 top
D19  SS26FL  [SOD-123']  55.24,9.61 180 top
D20  57.15,74.22 270 top
DSPLY  84.45,23.73 180 top
ENC  53.98,48.34 180 top
ESP  109.93,35.4 90 top
F1  16.83,12.78 270 top
FAN1  131.6,22.38 0 top
GND_OUT_CON  147.02,80.4 90 top
H1  31.75,111.84 0 top
H2  31.75,8.16 0 top
H3  144.12,8.16 0 top
H4  144.12,111.84 0 top
HS2  93.98,89.61 0 top
I_PROT  66.36,65.01 0 top
IC1  111.12,6.51 90 top
IC2  74.14,68.82 90 top
IC3  69.37,50.72 0 top
IC4  124.94,34.77 0 top
IC5  LD33V  [TO220V']  47.31,58.82 0 top
IC6  56.52,13.41 90 top
IC7  78.66,50.96 0 top
IC9  96.52,62.95 270 top
IC11  112.39,57.87 90 top
IC12  46.67,84.53 180 top
IC13  61.12,59.61 90 top
IC15  LD33V  [TO220V']  85.88,13.49 180 top
IC17  50.32,71.99 0 top
IC18  145.36,20.97 180 top
L1  69.22,10.24 90 top
L2  86.84,16.59 0 top
L3  41.75,34.92 180 top
L4  117,16.83 90 top
L5  49.29,55.64 0 top
LED  54.29,25.48 270 top
R1  71.91,62.15 270 top
R2  80.17,68.18 180 top
R3  80.17,66.28 180 top
R4  75.56,98.5 180 top
R5  51.75,92.79 270 top
R6  113.03,98.5 180 top
R7  54.13,78.98 180 top
R8  80.17,64.37 180 top
R9  71.44,72.63 0 top
R10  42.86,82.63 90 top
R11  79.38,27.07 180 top
R12  99.69,61.67 270 top
R13  106.36,25.88 180 top
R14  121.44,61.67 90 top
R15  117.63,61.67 270 top
R16  87,27.07 0 top
R17  125.25,29.69 180 top
R18  57.55,69.37 0 top
R19  125.25,27.46 0 top
R20  125.41,76.6 270 top
R21  88.9,80.72 90 top
R22  63.02,55.96 0 top
R23  65.88,57.71 90 top
R24  76.99,62.15 270 top
R25  127.98,58.83 270 top
R26  61.91,17.86 180 top
R27  58.1,17.86 180 top
R28  53.97,36.75 90 top
R29  56.51,36.75 90 top
R30  103.5,61.67 90 top
R31  139.07,29.62 180 top
R32  105.41,61.67 270 top
R33  121.44,30.96 90 top
R34  103.19,24.92 90 top
R35  112.39,61.75 0 top
R36  100.65,87.08 180 top
R37  110.81,52.07 270 top
R38  116.05,52.86 0 top
R39  113.19,52.07 270 top
R40  56.36,63.58 90 top
R41  59.05,55.01 270 top
R42  96.52,87.08 0 top
R48  139.07,27.4 0 top
REL1  141.95,59.15 90 top
SENSE  124.31,61.36 0 top
SG1  36.26,22.14 0 top
SJ1  93.5,100.33 0 top
T1  139.09,35.95 180 top
T2  106.36,58.1 90 top
T3  77.47,74.69 0 top
T4  74.14,61.2 270 top
T5  75.25,89.61 0 top
T6  112.71,89.61 0 top
T7  113.03,74.69 0 top
T8  128.61,63.28 0 top
T9  122.71,23.02 270 top
T10  119.22,56.83 90 top
T11  55.09,59.93 90 top
U$33  71.76,37.54 0 top
V_SEL  40.76,27.7 90 top
VOUT  138.44,80.43 270 top
VSS  28.26,17.23 0 top

### Tracks (layer width: path | path; a pad name or v marks a point on that pad's centre or on a via)
+3.3V
  Top 0.406: DSPLY.2 89.53,25.08 90.81,26.35 90.81,30.72 96.76,36.67 ESP.4
  Top 0.813: L2.2 C23.1 C24.1 DSPLY.2
+3.3V_A  (via drill 0.35)
  Top 0.305: 68.42,49.69 68.42,49.53 | C36.2 76.53,48.02 IC7.1
  Top 0.61: L5.2 50.29,53.78 C45.1 | C45.1 C46.1 | C45.1 50.24,52.47 51.75,50.96 v57.63,50.96 | C36.2 73.82,46.99 64.61,46.99 | v63.58,46.99 64.61,46.99 | C7.1 64.61,46.99 | 64.61,46.99
  Top 0.813: C7.1 C8.1 68.42,49.53 IC3.1
  Bottom 0.61: v63.58,46.99 61.59,46.99 v57.63,50.96
+5V_INT_D
  Top 0.203: R26.1 62.87,17.91 62.87,19.13 59.85,19.13 59.85,23.89 61.28,23.89 | 61.28,23.57 61.28,21.76 C37.+
  Top 0.813: 79.53,9.06 D12.C | D12.C 79.84,9.69 79.53,10 | 61.28,23.57 61.28,23.89 61.28,27.7 | V_SEL.2 61.28,27.7 | 61.28,27.7 65.72,27.7 66.99,26.43 71.75,26.43 73.98,24.21 73.98,17.38 77.87,13.49 C38.1 | C38.1 IC15.3 | C38.1 78.9,12.54 79.84,11.6 D12.C
  pour Top (isolate 0.305, no thermals): 60.33,19.77 66.36,19.77 66.36,13.73 72.07,13.73 72.07,23.57 62.23,23.57 62.23,24.53 60.33,24.53
+5V_USB
  Top 0.813: L3.1 42.75,36.94 C30.1 C31.1 42.7,44.05 U$33.VIN
+12V
  Top 0.813: D7.A 142.81,23.5 IC18.3 143.14,23.82 C41.1 143.14,28.88 144.13,29.87 D8.C
  Top 1.27: D8.C 145.76,44.24 REL1.-
+15V  (via drill 0.35)
  Top 0.305: C22.1 68.58,66.6 68.42,66.44 68.42,65.64 67.79,65.01 v63.78,65.01 | v73.82,67.55 73.82,70.09 75.56,71.83 77.79,71.83 78.74,72.79 78.74,79.45 79.38,80.09 91.6,80.09 95.64,84.14 R42.1
  Top 0.406: IC2.8 v71.28,65.96 | v73.18,57.55 v78.26,57.55 | D11.C 131.32,57.72 128.09,57.72 R25.2 124.84,54.69 122.71,54.69 | v109.54,54.69 109.54,55.64 IC11.8 109.46,55.88 108.03,55.88 C26.1 107.23,55.88 105.09,55.88 | v114.62,54.69 121.92,54.69 | 121.92,54.69 122.71,54.69 | C16.1 122.71,54.69 | v80.25,57.55 81.92,55.88 105.09,55.88 | T2.C 105.09,55.88 | 121.92,54.69 121.92,56.36 121.44,56.83 T10.C
  Top 0.61: IC2.8 69.69,66.91 C22.1 | C16.1 123.03,39.53 IC4.8 | IC17.3 52.94,69.37 R18.1 | C29.1 56.91,57.71 IC13.8
  Top 0.813: C43.1 52.55,69.14 IC17.3 52.86,73.89 D9.A | C43.1 v59.61,66.28 | C43.1 52.55,65.56 51.37,64.38 D13.C 51.99,62.24 51.99,59.93 | 51.99,59.93 C35.1 | IC5.3 C35.1 | C35.1 52.55,58.82 54.05,57.31 C29.1 | T11.C 51.99,59.93
  Bottom 0.406: v73.18,57.55 70.8,59.93 70.8,64.53 71.28,65.01 v71.28,65.96 72.23,65.96 v73.82,67.55 | v78.26,57.55 v80.25,57.55 | v109.54,54.69 v114.62,54.69
  Bottom 0.813: v59.61,66.28 62.51,66.28 v63.78,65.01
+15V_FAN
  Top 0.813: T9.2 117.95,23.02 117,22.07 C33.1 C32.1 L4.2
+18V  (via drill 0.6)
  Top 0.406: IC12.2 IC12.1 48.58,89.3 C27.2 51.75,93.11 R5.1
  Top 0.813: IC17.1 47.78,73.89 D9.C | D9.C 47.47,74.21 C42.1 47.31,76.28 44.77,76.28 40.96,80.09 40.96,99.73 | IC18.1 147.91,23.5 | D7.C 148.22,18.75 | D9.C 47.46,73.58 | C19.1 45.59,11.95 45.47,11.83 | 108.31,3.97 108.25,4.02
  Top 1.27: 147.91,23.5 D7.C | 148.22,18.75 C40.1 148.22,14.87 147.64,14.29 139.26,14.29 C12.+ 138.27,13.3 138.27,10.79 131.44,3.97 IC1.1 108.31,3.97 | C34.+ 31.69,21.6 D15.2 | C34.+ 45.47,11.83 | C34.+ 41.47,3.06 42.86,1.67 97.74,1.67 C10.+ 100.1,4.02 C14.1 108.25,4.02 D10.C
  other vias: 26.67,56.83 26.67,61.91 26.67,67.63 29.21,56.83 29.21,61.91 29.21,67.63 31.75,56.83 31.75,61.91 31.75,67.63 34.29,56.83 34.29,61.91 34.29,67.63 36.83,67.63 36.83,61.91 36.83,56.83 26.67,41.27 29.21,41.27 31.75,41.27 34.29,41.27 36.83,41.27 26.67,71.44 29.21,71.44 31.75,71.44 34.29,71.44 36.83,71.44
  pour Top (isolate 0.305, no thermals): 54.77,12.46 54.77,13.1 51.75,13.1 51.75,12.78 44.13,12.78 44.13,10.88 52.39,10.88 52.39,12.46
  pour Top (isolate 0.305): 25.72,71.52 25.72,27.07 37.15,27.07 37.15,83.9 31.11,89.93 31.11,95.65 53.98,95.65 53.98,106.44 24.45,106.36 24.45,111.84 14.92,111.84 14.92,78.19 19.05,78.19
  pour Bottom (isolate 0.305): 25.72,71.84 25.72,27.07 37.15,27.07 37.15,71.84
+V_ADJ
  Top 0.203: R30.2 103.5,64.85
  Top 0.406: R3.1 83.99,66.28 86.05,64.22 91.77,64.22 92.4,64.86 90.79,66.46 C15.+
  Top 0.813: C13.1 93.66,65.48
  pour Top (isolate 0.305, no thermals): 92.08,77.55 85.72,77.55 85.72,71.2 92.71,64.22 140.97,64.22 140.97,69.29 134.31,69.3 133.68,69.94 128.27,69.93 128.27,73.42 122.24,73.42 122.24,73.11 119.06,69.93 95.25,69.93 92.08,73.11
ADC_CH0
  Top 0.61: U$33.20/A6 59.06,52.31 C51.1 58.98,53.93 R41.2
ADC_CH1
  Top 0.406: U$33.33/A14 102.24,46.36 103.35,47.47 111.76,47.47 113.19,48.9 R39.2
  Top 0.61: R39.2 114.98,51.07 C50.1
ADC_CH2
  Top 0.406: U$33.34/A15 99.7,46.52 102.39,49.21 110.17,49.21 110.81,49.85 R37.2
  Top 0.813: C47.1 108.95,51.07 R37.2
ADC_CH3
  Top 0.61: R23.1 65.14,55.96 R22.2 64.02,54.1 C3.1 | C3.1 64.14,53.9 | C3.1 64.14,53.89 | C3.1 63.98,53.5 63.18,52.7 62.23,52.7 61.6,52.07 U$33.19/A5/SCL
ADC_SENSE
  Top 0.61: IC11.3 116.13,58.5 117.16,59.53 117.16,60.48 117.35,60.67 R15.2
  Top 0.813: R14.1 119.58,60.67 C25.1 117.68,60.72 R15.2
ADC_VOUT
  Top 0.203: 107.63,60.41 C48.1
  Top 0.61: C48.1 108.58,60.72 IC11.5
  Top 0.813: R30.1 R32.2 | R32.2 105.46,60.72 | R32.2 107.27,60.67 C48.1
AGND  (via drill 0.35)
  Top 0.305: IC7.12 78.01,54.99 v78.03,55.01 | IC7.8 80.61,54.97 v80.64,55.01
  Top 0.406: C27.1 v44.77,89.61 IC12.4 | R10.2 v42.86,85.17 | R12.2 99.33,61.04 IC9.3 | R32.1 107.27,62.67 C48.2 v108.74,62.63 | IC11.4 v115.25,61.52 | D11.A 129.72,60.42 v129.56,60.58 T8.E
  Top 0.61: IC2.4 v78.58,70.72 | IC13.4 v65.41,61.52 | C49.1 101.92,84.53 R36.1 | R18.2 v59.93,69.37 | C45.2 v53.42,55.33 | v41.75,55.64 C44.1 | C46.2 | C46.2 v45.01,53.74 | v69.37,53.5 69.37,52.07 IC3.3 | C36.1 75.01,49.93 v76.52,49.93 | v51.99,55.64 C35.2
  Top 0.813: C43.2 50.64,69.14 IC17.2 50.32,75.8 49.69,76.44 C42.2 v49.37,77.87 | v65.41,75.64 C11.2 | v93.66,59.77 C13.2 | v133.38,58.2 D6.A | C22.2 v69.53,63.42 | R2.1 v82.71,68.18 | R1.1 v71.91,64.22 | R22.1 v60.8,55.96 | C3.2 v60.8,54.05 | C7.2 C8.2 68.82,51.44 IC3.3 69.45,52.07 71.75,52.07 C9.2 | C26.2 107.79,53.42 v109.06,53.42 | R35.2 113.63,61.52 v115.25,61.52 | 106.92,51.04 C47.2 v105.65,51.12 | v118.43,52.78 117.12,52.78 R38.2 | v118.43,50.72 117.08,50.72 C50.2 | C25.2 117.68,62.63 R15.1 117.52,62.79 v116.05,62.79 | v56.52,54.21 C29.2 | R40.2 57.75,64.58 v57.78,64.61 | C51.2 v55.8,52.39
  pour Bottom (isolate 0.305, no thermals): 40.32,119.46 151.74,119.46 151.74,49.29 120.02,49.29 120.02,43.9 83.26,43.9 83.26,40.88 41.27,40.88 41.27,77.47 40.32,77.47
AREF2048
  Top 0.203: IC3.2 70.32,50.09 69.93,50.48 63.58,50.48
  Top 0.305: IC7.11 78.66,53.1 78.42,52.86 77.23,52.86 | 77.23,52.86 77.36,52.89 IC7.13 | U$33.AREF 52.71,43.89 62.55,43.89 62.87,44.21 62.87,50.16 63.18,50.48 63.58,50.48 | C9.1 73.03,50.17 73.03,50.48 75.41,52.86 77.23,52.86
  Top 0.813: IC3.2 72.31,49.45 C9.1
BTN_I_DOWN
  Top 1.27: U$33.39/A20 BTNS.4
BTN_I_UP
  Top 1.27: U$33.38/A19 BTNS.3
BTN_V_DOWN
  Top 1.27: U$33.37/A18 BTNS.2
BTN_V_UP
  Top 1.27: U$33.36/A17 BTNS.1
BUZZER  (via drill 0.35)
  Top 0.406: v47.94,26.43 45.32,26.43 41.04,22.15 SG1.+
  Bottom 0.406: U$33.2 v47.95,26.43 v47.94,26.43
CRNT_READ
  Top 0.203: 70.17,70.72 70.17,71.2 70.48,71.52 71.91,71.52 72.44,72.04 R9.2 | 67.47,70.72 70.17,70.72 | IC2.6 70.48,69.45 70.17,69.77 70.17,70.72
  Top 0.61: 66.52,71.52 67.31,70.72 67.47,70.72 | 66.52,71.52 66.52,71.36 60.17,65.01 60.17,62.55 59.13,61.52 | 60.48,77.55 59.05,78.98 R7.1 | 60.48,77.55 61.67,76.36 | 61.67,76.36 66.52,71.52 | 59.13,61.52 | 59.13,61.52 IC13.5 | D20.3 59.53,74.22 61.67,76.36 | C52.1 59.93,76.99 60.48,77.55
DAC_CS
  Top 0.305: IC7.3 78.01,47.53 77.31,46.83 75.88,46.83 74.3,45.25 U$33.14/A0
DAC_SHDN
  Top 0.305: IC7.9 79.96,51.17 81.92,49.21 U$33.A22/DAC1
DSPLY_CS
  Top 0.61: DSPLY.7 76.83,25.48 76.52,25.8 74.93,25.8 72.71,28.02 67.94,28.02 66.68,29.29 U$33.8
DSPLY_DC
  Top 0.203: DSPLY.3 U$33.26
DSPLY_RST
  Top 0.203: DSPLY.6 79.38,24.21 79.38,28.02 79.69,28.34 80.96,28.34 81.92,29.29 U$33.24
ENC_A
  Top 1.27: ENC.1 U$33.21/A7
ENC_B
  Top 1.27: U$33.22/A8 ENC.2
ENC_BTN
  Top 1.27: ENC.3 U$33.23/A9
ESP-IO
  Top 0.406: U$33.10/CS 71.76,30.56 75.56,34.37 81.76,34.37 86.2,38.81 91.04,38.81 91.44,39.21 ESP.5
ESP-RST
  Top 0.406: ESP.3 96.28,34.13 U$33.28
ESP-RX
  Top 0.406: ESP.2 101.36,31.59 U$33.31/A12
ESP-TX
  Top 0.406: ESP.1 103.11,29.05 U$33.32/A13
FAN-OUT
  Top 0.406: R13.2 105.31,25.92 R34.2 103.14,25.88 96.04,25.88 94.62,27.3 U$33.29
GND_OUT_CON
  pour Top (isolate 0.305, no thermals): 149.56,70.57 142.89,70.57 142.89,84.86 149.56,84.86
ISET
  Top 0.305: IC2.5 72.39,70.72 72.71,70.41 72.71,65.64 72.23,65.17 71.6,65.17 70.8,64.37 70.8,62.95 70.17,62.31 69.37,62.31 68.9,61.83 68.9,58.66 71.91,55.64 75.49,55.64 76.71,54.42 IC7.14
LED1
  Top 0.152: U$33.3/CANTX R28.1
LED2
  Top 0.152: U$33.4/CANRX R29.1
MOSI  (via drill 0.35)
  Top 0.305: IC7.5 79.31,47.13 79.69,46.75 80.17,46.75 80.64,46.28 80.64,40.08 v83.11,37.62
  Top 0.406: 81.48,26.55 83.19,28.26 83.19,33.97 v84.97,35.76
  Top 0.61: R11.1 80.96,27.07 81.48,26.55 81.91,26.12 DSPLY.5
  Top 1.27: R11.1
  Bottom 0.305: v83.11,37.62 v84.97,35.76
N$1
  Top 0.406: C28.1 60.8,11.51 IC6.1
N$2  (via drill 0.6)
  other vias: 11.11,11.11 11.11,6.99 11.11,3.17 13.02,3.17 13.02,6.99 13.02,11.11 16.83,11.11 19.37,11.11 16.83,5.08 19.37,5.08
  pour Top (isolate 0.305, no thermals): 5.08,1.03 20.16,1.03 20.16,13.1 5.08,13.1
  pour Bottom (isolate 0.305, no thermals): 5.08,1.03 20.16,1.03 20.16,13.1 5.08,13.1
N$3
  Top 0.406: IC12.8 50.16,81.68 50.48,81.36 R5.2
  Top 0.813: C11.1 65.41,82.63 R5.2
  Top 1.27: T6.C 112.71,77.23 113.03,76.92 T7.2 | 112.71,89.93 T6.C | T6.C 112.39,86.76 112.39,93.42 121.92,93.42 121.93,93.43 131.13,84.24 D14.C | T3.2 77.47,79.61 75.25,81.84 T5.C
  pour Top (isolate 0.305, no thermals): 50.16,87.08 50.16,80.72 67.94,80.72 67.94,90.25 73.03,90.25 73.03,83.27 77.47,83.27 77.47,90.25 110.49,90.25 110.49,83.27 114.94,83.27 114.94,96.6 62.87,96.6 62.87,87.08
N$4  (via drill 0.35)
  Top 0.406: 118.43,86.19 T6.E | v116.2,98.5 R6.1
  Top 0.61: D3.1 118.43,86.19
  Bottom 0.406: v116.2,98.5 118.11,96.6 118.11,86.5 T6.E
  pour Top (isolate 0.305, no thermals): 116.84,88.66 123.53,88.66 128.92,83.27 128.9,79.77 120.99,79.77 120.98,83.27 116.84,83.27
N$5  (via drill 0.35)
  Top 0.406: v109.86,98.5 R6.2 112.03,100.06 111.76,100.33 SJ1.2
  Top 1.27: T7.1 110.49,76.12 107.25,79.36 T6.B
  Bottom 0.406: v109.86,98.5 107.25,95.9 T6.B
N$6
  Top 0.61: C6.1 75.41,67.87 75.72,68.18 IC2.2 R2.2 R3.2 R8.2
N$7
  Top 0.406: R10.1 44.72,81.63 IC12.5
  Top 0.61: IC12.5 44.77,80.17 45.56,79.38 52.74,79.38 R7.2 53.13,77.91 54.73,76.32 | 54.73,76.32 D20.1 | C52.2 55.4,76.99 54.73,76.32
N$8  (via drill 0.35)
  Top 0.406: 80.96,86.19 T5.E | v78.74,98.5 R4.1
  Top 0.61: D2.1 80.96,86.19
  Bottom 0.406: v78.74,98.5 80.71,96.54 T5.E
  pour Top (isolate 0.305, no thermals): 79.38,88.98 92.08,88.98 92.08,83.27 79.38,83.27
N$9
  Top 0.61: R16.2 88.58,27.07 89.54,28.02 U$33.27
N$10
  Top 0.61: I_PROT.1 66.36,61.99 67.63,60.72 D1.3 67.84,60.03 D4.C
N$11
  Top 0.406: R25.1 127.66,60.15 T8.B
N$12
  Top 1.27: T1.2 139.09,42.55 D8.A 139.03,45.88 REL1.+
  pour Top (isolate 0.305, no thermals): 137.18,31.5 137.18,34.36 138.45,34.36 138.45,40.39 139.72,40.39 139.72,34.36 140.99,34.36 140.99,31.5
N$13
  pour Top (isolate 0.305, no thermals): 54.29,11.83 53.02,11.83 53.02,3.41 72.07,3.41 72.07,9.92 59.05,9.92 59.05,8.02 54.29,8.02
N$14  (via drill 0.6)
  other vias: 19.68,58.74 16.51,55.56 13.97,58.74 11.43,58.74 22.86,58.74 22.86,44.13 20.32,44.13 20.32,48.58 22.86,48.58 22.86,53.66 20.32,53.66 11.43,62.87 13.97,62.87 19.68,62.87 22.86,62.87
  pour Top (isolate 0.305, no thermals): 10.48,65.56 10.48,42.94 23.49,42.94 23.49,65.56
  pour Bottom (isolate 0.305, no thermals): 10.48,65.56 10.48,42.94 23.49,42.94 23.49,65.56
N$15  (via drill 0.35)
  Top 0.406: v72.39,98.5 R4.2 74.56,99.97 74.93,100.33 SJ1.1
  Top 1.27: T5.B 69.79,83.33 74.77,78.34 74.77,74.85 T3.1
  Bottom 0.406: v72.39,98.5 69.79,95.9 T5.B
N$16
  Top 0.406: IC9.2 96.79,62.67 R12.1
N$17
  Top 0.61: R11.2 75.57,27.07 75.56,27.07 74.3,28.34 U$33.11/MOSI
N$18
  Top 0.406: IC4.7 IC4.6
N$19
  Top 0.406: T4.2 71.99,61.2 R1.2
N$20  (via drill 0.35)
  Top 0.152: R28.2 51.44,35.21 51.44,32.38 v52.7,31.11
  Bottom 0.152: v52.7,31.11 52.7,25.8 LED.1
N$21
  Top 0.61: IC2.1 76.99,65.33 C6.2 76.99,64.69 R24.1 76.95,63.1 T4.1
N$22  (via drill 0.35)
  Top 0.61: C4.2 77.9,61.15 R24.2 76.99,59.61 76.68,59.29 T4.3 71.6,59.29 | 70.8,59.29 D1.1 | 70.75,59.24 70.8,59.29 | 70.8,59.29 71.6,59.29 | D3.3 117.47,78.5 115.57,76.6 T7.3 115.57,72.95 114.3,71.68 107.31,71.68 105.41,73.58 105.41,76.28 102.87,78.82 D2.3 T3.3 80.01,71.83 81.28,70.56 v81.28,69.93 | D4.A 71.54,59.24 71.6,59.29
  Bottom 0.61: T4.3 78.11,59.29 81.28,62.47 v81.28,69.93
N$23  (via drill 0.35)
  Top 0.152: R29.2 59.05,35.21 59.05,32.38 v57.78,31.11
  Bottom 0.152: v57.78,31.11 57.78,28.57 55.56,26.35 LED.2
N$24
  Top 0.61: IC6.4 59.1,15.33 R27.1 R26.2
N$25  (via drill 0.6)
  other vias: 11.43,26.67 13.97,26.67 16.51,26.67 19.05,26.67 21.59,26.67 11.43,23.81 11.43,20 21.59,20 21.59,23.81 22.23,28.89 22.23,33.97 20.32,33.97 22.23,38.42 20.32,38.42 20.32,28.89
  pour Bottom (isolate 0.305, no thermals): 10.16,39.69 23.5,39.69 23.5,17.78 10.16,17.78
  pour Top (isolate 0.305, no thermals): 10.16,39.69 23.5,39.69 23.5,17.78 10.16,17.78
N$26
  pour Bottom (isolate 0.305): 40.01,36.51 40.01,76.2 37.15,76.2 37.15,73.66 38.73,73.66 38.73,36.51
N$27
  Top 0.61: C4.1 81.12,64.33 R8.1
N$28
  Top 0.61: C5.1 69.69,72.63 R9.1
N$29
  pour Bottom (isolate 0.305): 36.2,118.9 41.27,118.9 41.27,101.92 36.2,101.92
N$30  (via drill 0.35)
  Top 0.406: R13.1 C17.2 115.25,25.88 118.9,29.53 118.9,32.54 120.17,33.81 124.94,33.81 125.57,33.18 | 125.57,33.18 IC4.3 | 125.57,33.18 126.21,33.18 v126.84,33.81 | v126.84,36.04 IC4.5
  Bottom 0.406: v126.84,33.81 v126.84,36.04
N$31
  Top 0.203: R17.1 125.57,29.69 125.25,29.37 125.25,19.83
  Top 0.813: T9.3 121.44,20.48 122.09,19.83 125.25,19.83 D5.C 128.44,21.11 FAN1.1
N$32
  Top 0.61: IC4.2 124.3,29.73 R17.2 R19.1
N$33
  Top 0.61: T9.1 121.44,25.56 R33.1
N$34
  Top 0.406: IC4.1 121.49,31.91 R33.2
N$35
  Top 0.813: C39.2 D12.A 84.94,10.96 85.88,11.9 IC15.2 85.88,16.54 L2.1
N$36
  Top 0.813: V_SEL.3 L3.2
N$37
  Top 0.406: T1.1 141.95,38.49 141.95,29.94 141.62,29.61 141.61,29.62 R31.1
  Top 0.813: R31.1 R48.2
N$38
  Top 0.813: D10.A 108.83,9.05 IC1.3 114.94,9.05 115.52,8.47 C18.1 L4.1
N$39
  Top 0.61: D13.A 47.31,61.82 IC5.2 47.47,58.66 47.47,55.64 | C44.2 47.47,55.64 | 47.47,55.64 L5.1
N$40
  Top 0.61: T2.B 107.71,57.23 IC11.7
N$41
  Top 0.61: T2.E 108.19,58.5 IC11.6 111.36,58.5 111.44,58.58 | R37.1 110.81,54.61 111.44,55.24 111.44,58.58 | R35.1 111.44,61.71 111.44,58.58
N$42
  Top 0.406: IC11.1 115.81,55.96 116.05,55.72 120.33,55.72
  Top 0.61: T10.B 120.33,55.72
N$43
  Top 0.406: IC11.2 116.28,57.23 117,57.94 120.33,57.94
  Top 0.61: T10.E 120.33,57.94 | IC11.2 113.75,57.23 113.19,56.67 R39.1 114.84,53.07 R38.1
N$44
  Top 0.61: T11.B 56.52,58.98 IC13.7
N$45
  Top 0.61: T11.E 56.99,60.25 IC13.6 59.45,60.25 59.85,59.85 59.85,56.8 R41.1
  Top 0.813: T11.E R40.1
OVRCRNT_DET
  Top 0.61: 68.74,68.18 66.99,68.18 66.36,67.55 I_PROT.2 63.58,66.28 62.55,65.25 62.55,60.56 62.87,60.25 IC13.3 | 68.74,68.18 IC2.7 | 68.74,68.18 C5.2
OVRCRNT_DET_BUF
  Top 0.61: R23.2 65.61,58.98 IC13.2 IC13.1
P_VSS  (via drill 0.35)
  other vias: 2.54,39.05 1.91,36.2 2.54,33.66 4.76,33.66 7.3,33.66 7.3,36.2 7.3,39.05 4.76,39.05 7.3,31.43 7.3,29.21 4.76,29.21 2.54,29.21 1.91,31.43 7.3,44.13 4.76,44.13 2.54,44.13 1.91,46.04 7.3,46.04 7.3,48.58 4.76,48.58 2.54,48.58 1.91,51.12 7.3,51.12 7.3,53.98 4.76,53.98 2.54,53.98 7.3,77.79 4.76,77.79 2.54,77.79 7.3,67.31 4.76,67.31 2.54,67.31 7.3,60.33 4.76,60.33 2.54,60.33 2.54,93.03 2.54,100.01 5.71,100.01 5.71,93.03 8.57,100.01 8.57,93.03 1.59,41.59 3.49,41.59 5.71,41.59 7.62,41.59 2.54,72.39 4.76,72.39 7.3,72.39
  pour Bottom (isolate 0.305): 0,120.02 38.73,120.02 38.73,73.98 8.57,73.98 8.57,28.34 1.27,28.34 1.27,73.98 0,73.98
  pour Top (isolate 0.305): 8.57,28.34 1.27,28.34 1.27,111.84 10.16,111.84 10.16,75.56 8.57,73.98
REL-OUT
  Top 0.406: R31.2 133.65,29.62 128.43,34.85 118.83,34.85 111.44,27.46 98.19,27.46 97.16,28.49 U$33.30
SCK  (via drill 0.35)
  Top 0.305: IC7.4 78.66,46.59 78.11,46.04 78.11,40.16 v81.92,36.35
  Top 0.406: R16.1 85.72,27.34 85.72,32.54 v84.53,33.73
  Top 0.61: R16.1 85.41,27.07 84.45,26.11 DSPLY.4
  Top 1.27: R16.1
  Bottom 0.305: v81.92,36.35 v84.53,33.73
SENSE
  Top 0.406: R14.2 121.49,62.63
  Top 1.27: R14.2 124.27,62.67 SENSE.2
TH0  (via drill 0.35)
  Top 0.406: C49.2 v99.06,79.93 | v99.06,77.71 v99.06,70.88 | v101.44,63.26 v101.44,57.07 | v101.44,54.85 97.16,50.56 U$33.35/A16
  Top 0.61: C49.2 99.38,84.53 R36.2 R42.2
  Bottom 0.406: v99.06,79.93 v99.06,77.71 | v99.06,70.88 101.44,68.5 v101.44,63.26 | v101.44,57.07 v101.44,54.85
V_OUT_CON
  pour Top (isolate 0.305, no thermals): 140.98,70.57 135.27,70.57 135.27,84.86 140.98,84.86
VSET
  Top 0.203: IC2.3 79.85,69.45 80.17,69.14 80.17,60.88
  Top 0.305: 80.17,60.88 79.31,60.02 IC7.10
VSS  (via drill 0.35)
  Top 0.406: v136.53,27.4 R48.1 | T1.3 v136.87,36.58 | C41.2 145.36,26.36 | 46.04,36.51 v47.47,36.51 47.47,38.58 46.99,39.05 C31.2
  Top 0.61: v103.19,22.54 R34.1 | R19.2 v127.79,27.46 127.79,25.57 D5.A | v128.11,31.91 IC4.4 | C16.2 v119.22,39.85 | C30.2 46.04,36.51 | C32.2 113.51,20 v113.51,21.59 C33.2 | C17.1 v109.54,21.11
  Top 0.813: IC15.1 88.42,13.18 90.33,11.27 C39.1 | C40.2 146,16.52 145.36,17.16 IC18.2 145.04,23.82 C41.2 | C14.2 106.36,6.56 113.61,6.56 IC1.2 116.94,6.51 C18.2 | C38.2 v78.9,16.98 | C24.2 91.52,18.73 v92.87,18.73 92.87,16.75 C23.2
  other vias: 45.72,16.43 45.72,17.7 48.26,17.7 48.26,16.43 50.8,16.43 50.8,17.7 56.2,20.56 56.2,22.78 56.2,21.67
  pour Bottom (isolate 0.305, no thermals): 25.08,0.27 25.08,25.8 38.73,25.8 38.73,39.45 84.61,39.45 84.61,42.62 121.28,42.62 121.28,48.02 151.74,48.02 151.74,0.27
  pour Top (isolate 0.305, no thermals): 55.24,13.73 44.13,13.73 44.13,23.57 59.37,23.57 59.37,19.77 57.78,19.77 57.78,8.65 55.24,8.65

### Text on the board
tNames: + | + | CS RST MOSI SCK DC 3.3 VSS | V_SEL: / 1-2: Flash mode / 2-3: Normal operation | + | © 2019 azzurro@ne-mail.net | Input Voltage AC / 18V - 24V | Netzteil_Darlington_v2 / Rev 1.6
tDocu: HS: / ATS-52350P-C1-R0 / ATS-54350R-C1-R0